# Altium project master.PrjPcb (part 3 of 4)

## Sheet connector_to_BMS_extension.SchDoc: foxBMS BMS-Master
size A3; DocumentNumber: 24; SheetNumber: 24; SheetTotal: 24; Author: Fraunhofer IISB foxBMS Team; REL-DATE: 2017-05-16; VERSION: 1.0.2; SheetDescription: Connectors to BMS-Extension
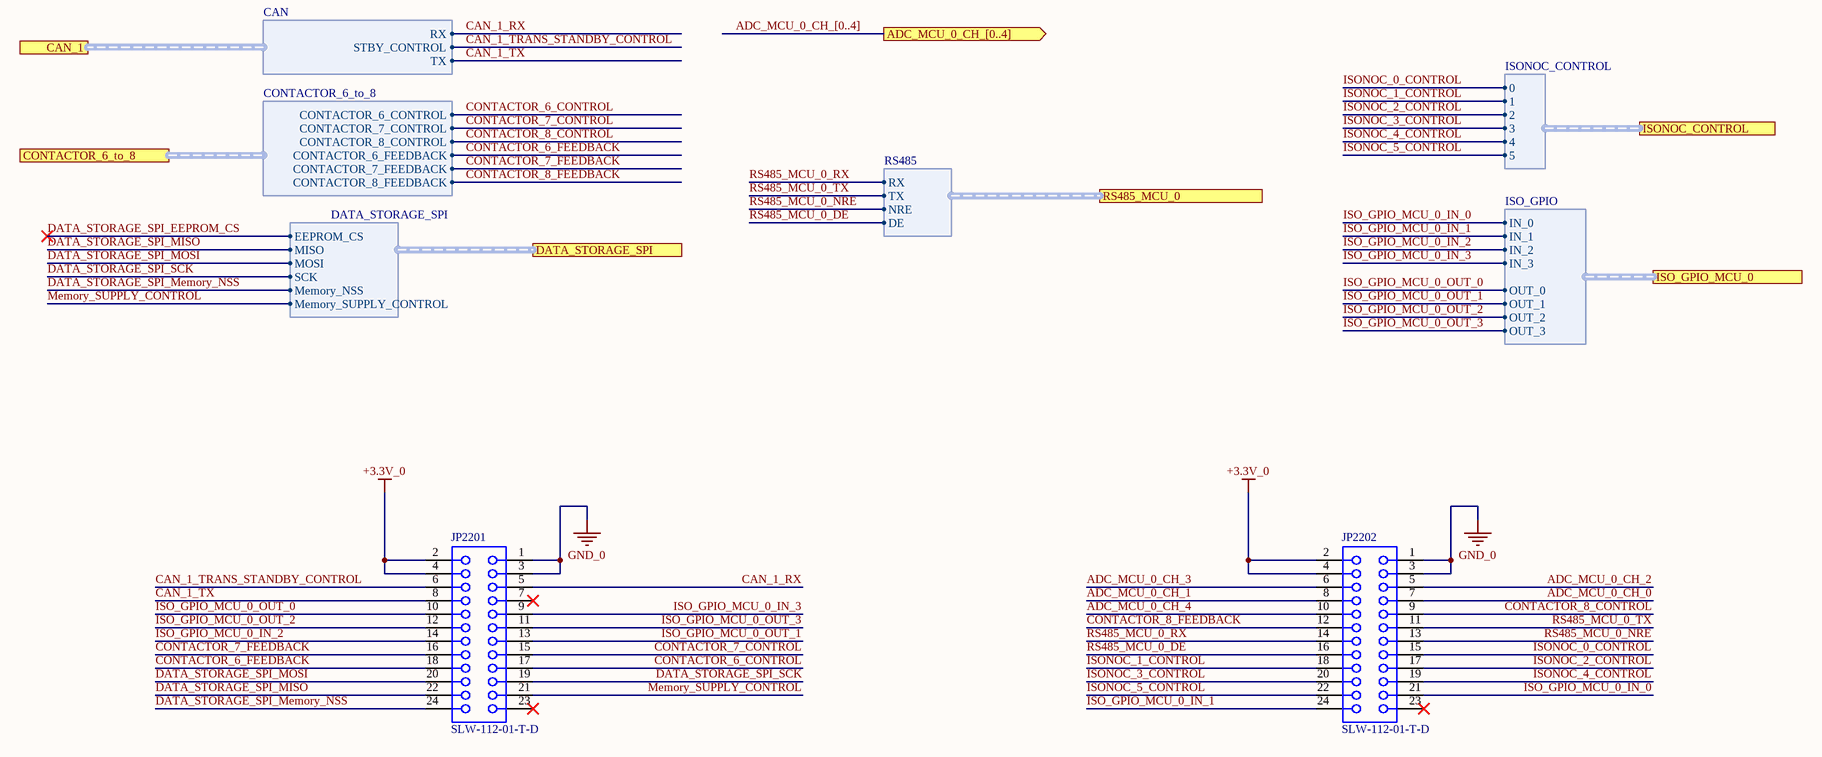
[diagram p17: connector_to_BMS_extension.SchDoc]

### Parts
JP2201  SLW-112-01-T-D  [SMTC-SLW-112-01-X-D]
JP2202  SLW-112-01-T-D  [SMTC-SLW-112-01-X-D]

### Ports
ADC_MCU_0_CH_[0..4] (out), CAN_1 (harness CAN), CONTACTOR_6_to_8 (harness CONTACTOR_6_to_8), DATA_STORAGE_SPI (harness DATA_STORAGE_SPI), ISO_GPIO_MCU_0 (harness ISO_GPIO), ISONOC_CONTROL (harness ISONOC_CONTROL), RS485_MCU_0 (harness RS485)

### Harnesses
CAN: RX, STBY_CONTROL, TX
CONTACTOR_6_to_8: CONTACTOR_6_CONTROL, CONTACTOR_7_CONTROL, CONTACTOR_8_CONTROL, CONTACTOR_6_FEEDBACK, CONTACTOR_7_FEEDBACK, CONTACTOR_8_FEEDBACK
DATA_STORAGE_SPI: EEPROM_CS, MISO, MOSI, SCK, Memory_NSS, Memory_SUPPLY_CONTROL
RS485: RX, TX, NRE, DE
ISONOC_CONTROL: 0, 1, 2, 3, 4, 5
ISO_GPIO: IN_0, IN_1, IN_2, IN_3, OUT_3, OUT_0, OUT_1, OUT_2

### Nets
+3.3V_0: JP2201.2 JP2201.4 JP2202.2 JP2202.4
GND_0: JP2201.1 JP2201.3 JP2202.1 JP2202.3
ADC_MCU_0_CH_0: JP2202.7
ADC_MCU_0_CH_1: JP2202.8
ADC_MCU_0_CH_2: JP2202.5
ADC_MCU_0_CH_3: JP2202.6
ADC_MCU_0_CH_4: JP2202.10
CAN_1_RX: JP2201.5 ; port CAN_1.RX
CAN_1_TRANS_STANDBY_CONTROL: JP2201.6 ; port CAN_1.STBY_CONTROL
CAN_1_TX: JP2201.8 ; port CAN_1.TX
CONTACTOR_6_CONTROL: JP2201.17 ; port CONTACTOR_6_to_8.CONTACTOR_6_CONTROL
CONTACTOR_6_FEEDBACK: JP2201.18 ; port CONTACTOR_6_to_8.CONTACTOR_6_FEEDBACK
CONTACTOR_7_CONTROL: JP2201.15 ; port CONTACTOR_6_to_8.CONTACTOR_7_CONTROL
CONTACTOR_7_FEEDBACK: JP2201.16 ; port CONTACTOR_6_to_8.CONTACTOR_7_FEEDBACK
CONTACTOR_8_CONTROL: JP2202.9 ; port CONTACTOR_6_to_8.CONTACTOR_8_CONTROL
CONTACTOR_8_FEEDBACK: JP2202.12 ; port CONTACTOR_6_to_8.CONTACTOR_8_FEEDBACK
DATA_STORAGE_SPI_Memory_NSS: JP2201.24 ; port DATA_STORAGE_SPI.Memory_NSS
DATA_STORAGE_SPI_MISO: JP2201.22 ; port DATA_STORAGE_SPI.MISO
DATA_STORAGE_SPI_MOSI: JP2201.20 ; port DATA_STORAGE_SPI.MOSI
DATA_STORAGE_SPI_SCK: JP2201.19 ; port DATA_STORAGE_SPI.SCK
ISO_GPIO_MCU_0_IN_0: JP2202.21 ; port ISO_GPIO_MCU_0.IN_0
ISO_GPIO_MCU_0_IN_1: JP2202.24 ; port ISO_GPIO_MCU_0.IN_1
ISO_GPIO_MCU_0_IN_2: JP2201.14 ; port ISO_GPIO_MCU_0.IN_2
ISO_GPIO_MCU_0_IN_3: JP2201.9 ; port ISO_GPIO_MCU_0.IN_3
ISO_GPIO_MCU_0_OUT_0: JP2201.10 ; port ISO_GPIO_MCU_0.OUT_0
ISO_GPIO_MCU_0_OUT_1: JP2201.13 ; port ISO_GPIO_MCU_0.OUT_1
ISO_GPIO_MCU_0_OUT_2: JP2201.12 ; port ISO_GPIO_MCU_0.OUT_2
ISO_GPIO_MCU_0_OUT_3: JP2201.11 ; port ISO_GPIO_MCU_0.OUT_3
ISONOC_0_CONTROL: JP2202.15 ; port ISONOC_CONTROL.0
ISONOC_1_CONTROL: JP2202.18 ; port ISONOC_CONTROL.1
ISONOC_2_CONTROL: JP2202.17 ; port ISONOC_CONTROL.2
ISONOC_3_CONTROL: JP2202.20 ; port ISONOC_CONTROL.3
ISONOC_4_CONTROL: JP2202.19 ; port ISONOC_CONTROL.4
ISONOC_5_CONTROL: JP2202.22 ; port ISONOC_CONTROL.5
Memory_SUPPLY_CONTROL: JP2201.21 ; port DATA_STORAGE_SPI.Memory_SUPPLY_CONTROL
RS485_MCU_0_DE: JP2202.16 ; port RS485_MCU_0.DE
RS485_MCU_0_NRE: JP2202.13 ; port RS485_MCU_0.NRE
RS485_MCU_0_RX: JP2202.14 ; port RS485_MCU_0.RX
RS485_MCU_0_TX: JP2202.11 ; port RS485_MCU_0.TX

Not connected (* = marked no-connect by the designer): JP2201 7* 23*; JP2202 23*

### Buses and harness runs
bus ADC_MCU_0_CH_[0..4] = port ADC_MCU_0_CH_[0..4]

### Notes on the sheet
- Fraunhofer IISB
- Schottkystr. 10
- developed by:
- 91058 Erlangen
- Germany
- Author
- Project
- License
- Description
- File
- Version
- Release Date
- Sheet
- www.foxbms.org
- www.iisb.fraunhofer.de
- foxBMS Team
- /

### Library data of the parts
JP2201 JP2202 = CMP-1023-00145-1: Low Profile Socket Strips, Through-hole, Vertical, -55 to 105 degC, 2.54 mm Pitch, 24-Pin, Female, RoHS; Manufacturer: Samtec; Pitch: 2.54 mm; DatasheetVersion: F-214; ComponentLink3Description: Package Specification; Orientation: Vertical; ComponentLink3URL: http://www.samtec.com/documents/webfiles/cpdf/SLW-1XX-01-X-X-MKT.pdf; ComponentLink1URL: http://www.samtec.com; Temperature Range: -55 to 105 degC; PackageReference: SLW-112-01-X-D; PartNumber: SLW-112-01-T-D; ComponentLink1Description: Manufacturer URL; PackageDescription: Low Profile Socket Strip; Mounting Technology: Through-hole; ComponentLink2Description: Datasheet; RoHS: True; ComponentLink2URL: http://www.samtec.com/documents/webfiles/pdf/SLW.PDF; PackageVersion: X, 9/1987

## Sheet interlock_circuit.SchDoc: foxBMS BMS-Master
size A3; DocumentNumber: 15; SheetNumber: 15; SheetTotal: 24; Author: Fraunhofer IISB foxBMS Team; REL-DATE: 2017-05-16; VERSION: 1.0.2; SheetDescription: Interlock Circuit
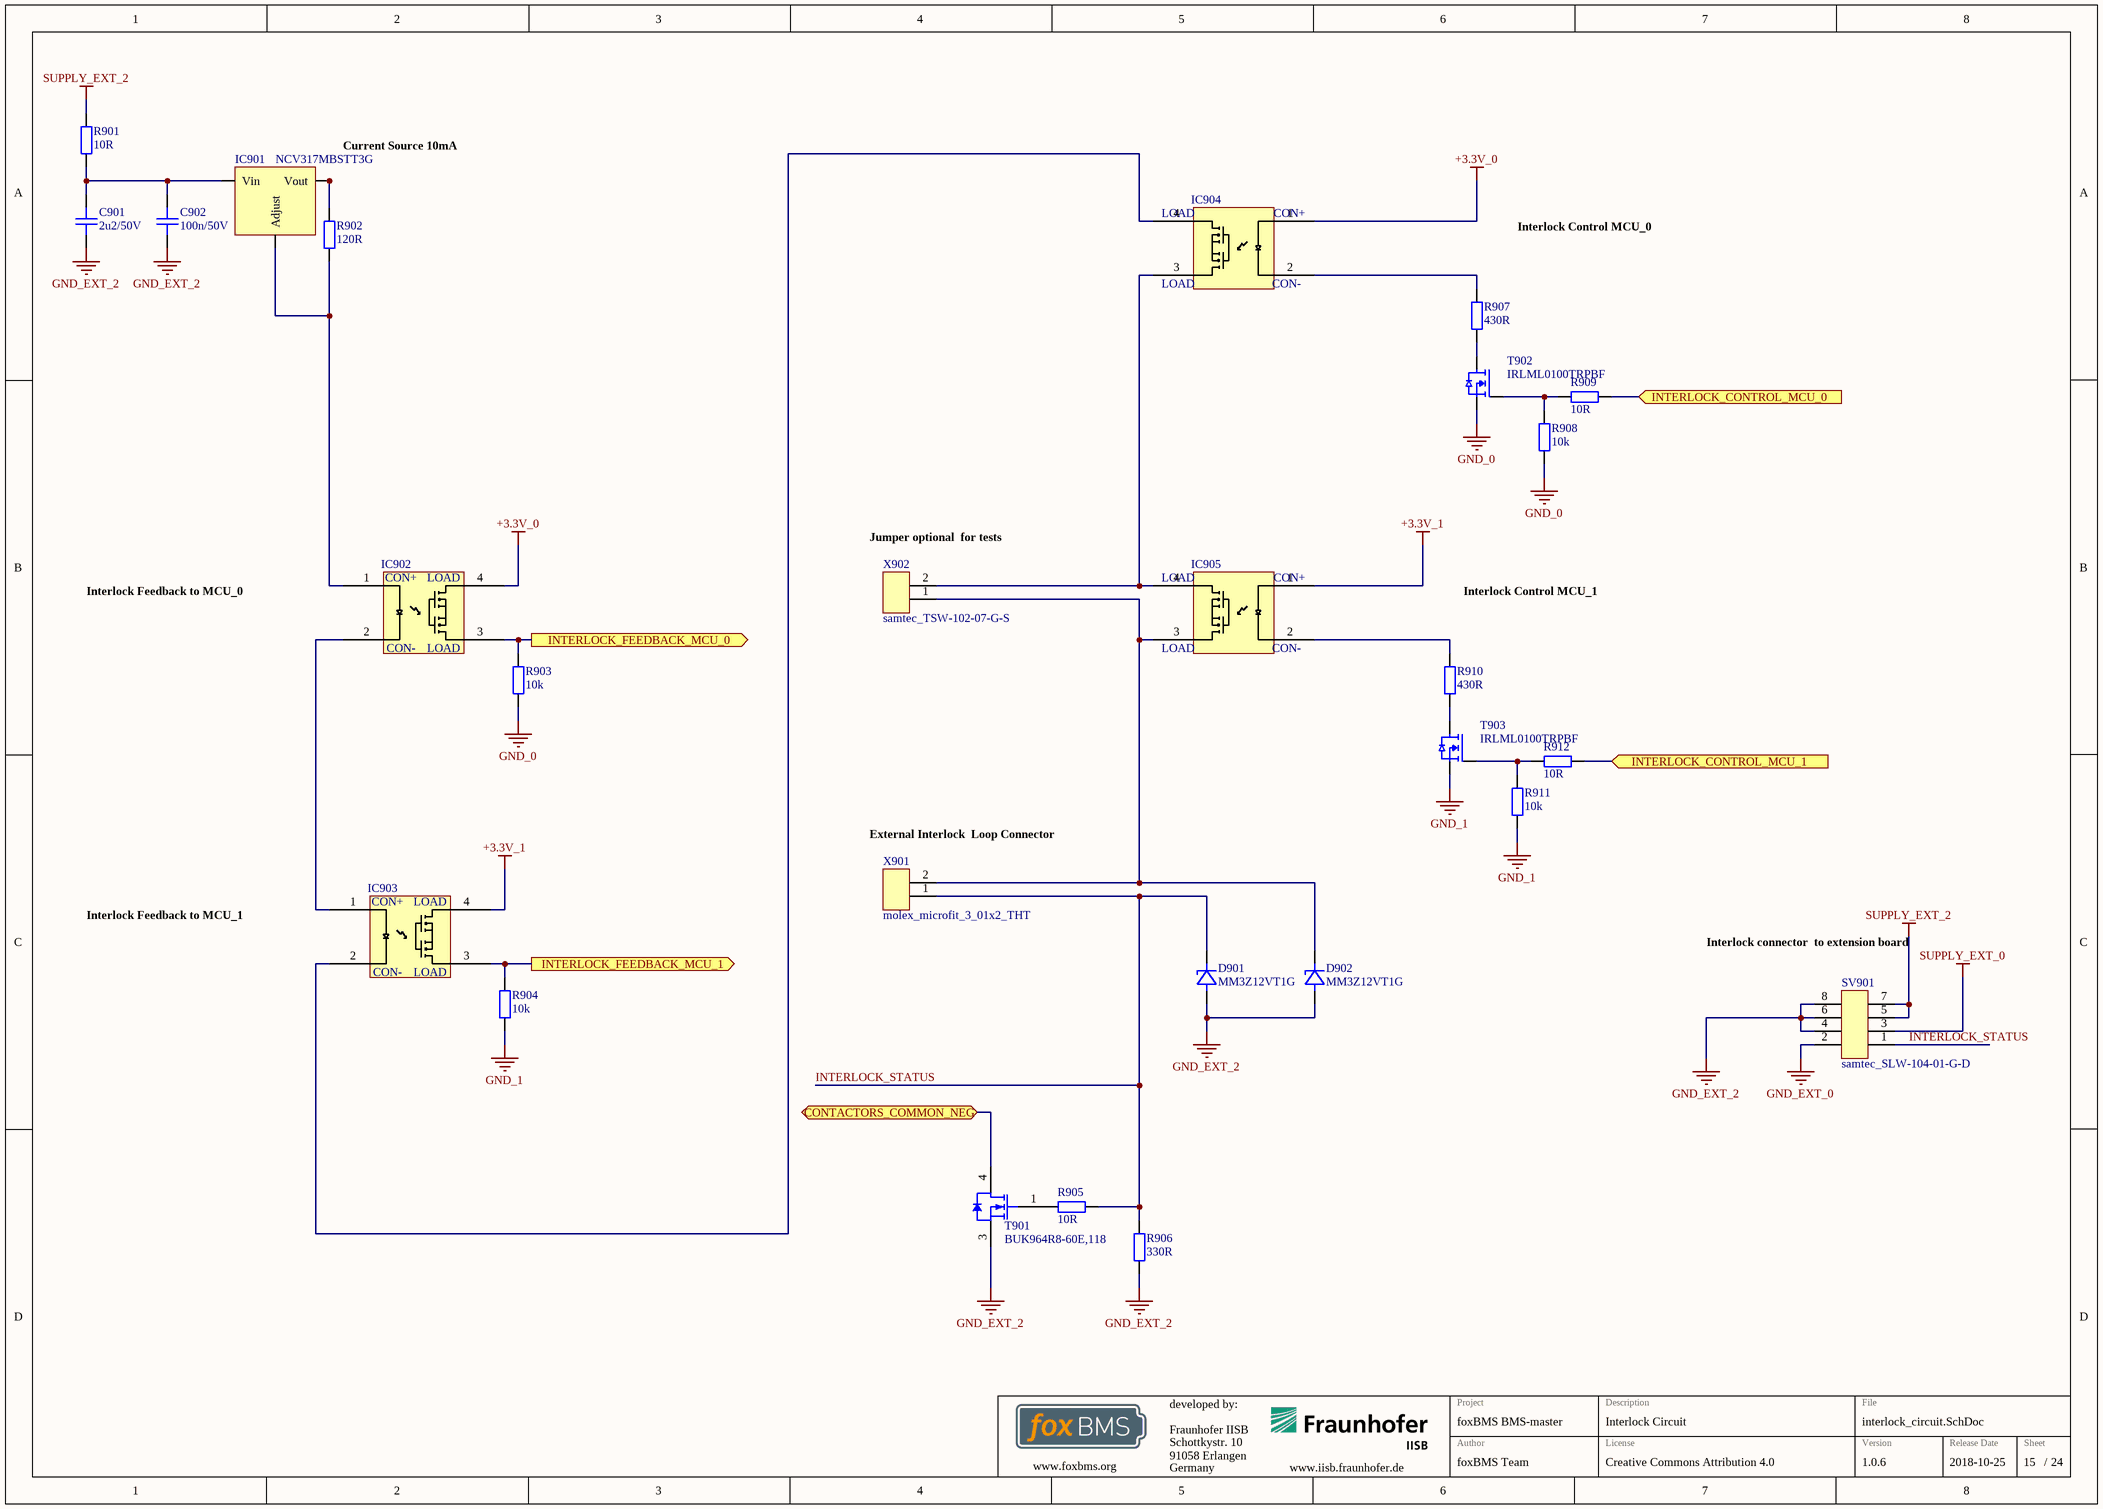
[diagram p18: interlock_circuit.SchDoc]

### Parts
C901  2u2/50V  [CAPC2012X14N]
C902  100n/50V  [CAPC1608X08N]
D901  MM3Z12VT1G  [SODFL250X110-2N]
D902  MM3Z12VT1G  [SODFL250X110-2N]
IC901  NCV317MBSTT3G  [SOT230P700X180-4N]
IC902  CPC1008N  [SOP254P610X218-4N]  (value not drawn)
IC903  CPC1008N  [SOP254P610X218-4N]  (value not drawn)
IC904  CPC1008N  [SOP254P610X218-4N]  (value not drawn)
IC905  CPC1008N  [SOP254P610X218-4N]  (value not drawn)
R901  10R  [RESC1608X05N]
R902  120R  [RESC1608X05N]
R903  10k  [RESC1608X05N]
R904  10k  [RESC1608X05N]
R905  10R  [RESC1608X05N]
R906  330R  [RESC1608X05N]
R907  430R  [RESC1608X05N]
R908  10k  [RESC1608X05N]
R909  10R  [RESC1608X05N]
R910  430R  [RESC1608X05N]
R911  10k  [RESC1608X05N]
R912  10R  [RESC1608X05N]
SV901  samtec_SLW-104-01-G-D  [SLW_104_01_G_D]
T901  BUK964R8-60E,118  [NXP-SOT404_M]
T902  IRLML0100TRPBF  [SOT95P237X110-3N]
T903  IRLML0100TRPBF  [SOT95P237X110-3N]
X901  molex_microfit_3_01x2_THT  [MOLEX_MICROFIT_01x2_THT]
X902  samtec_TSW-102-07-G-S  [Pinheader_2.54_2]

### Ports
CONTACTORS_COMMON_NEG (bidir), INTERLOCK_CONTROL_MCU_0 (in), INTERLOCK_CONTROL_MCU_1 (in), INTERLOCK_FEEDBACK_MCU_0 (out), INTERLOCK_FEEDBACK_MCU_1 (out)

### Nets
+3.3V_0: IC902.4 IC904.1
+3.3V_1: IC903.4 IC905.1
GND_0: R903.1 R908.2 T902.S
GND_1: R904.1 R911.2 T903.S
GND_EXT_0: SV901.2
GND_EXT_2: C901.2 C902.2 D901.2(A) D902.2(A) R906.1 SV901.4 SV901.6 SV901.8 T901.3(S)
SUPPLY_EXT_0: SV901.3
SUPPLY_EXT_2: R901.2 SV901.5 SV901.7
CONTACTORS_COMMON_NEG: T901.4(D) ; port CONTACTORS_COMMON_NEG
INTERLOCK_CONTROL_MCU_0: R909.2 ; port INTERLOCK_CONTROL_MCU_0
INTERLOCK_CONTROL_MCU_1: R912.2 ; port INTERLOCK_CONTROL_MCU_1
INTERLOCK_FEEDBACK_MCU_0: IC902.3 R903.2 ; port INTERLOCK_FEEDBACK_MCU_0
INTERLOCK_FEEDBACK_MCU_1: IC903.3 R904.2 ; port INTERLOCK_FEEDBACK_MCU_1
INTERLOCK_STATUS: D901.1(K) R905.1 R906.2 SV901.1 X901.1
NetC901_1: C901.1 C902.1 IC901.3(Vin) R901.1
NetD902_1: D902.1(K) IC905.3 X901.2 X902.1
NetIC901_1: IC901.1(Adjust) IC902.1 R902.1
NetIC901_2: IC901.2(Vout) IC901.4(Vout) R902.2
NetIC902_2: IC902.2 IC903.1
NetIC903_2: IC903.2 IC904.4
NetIC904_2: IC904.2 R907.2
NetIC904_3: IC904.3 IC905.4 X902.2
NetIC905_2: IC905.2 R910.2
NetR905_2: R905.2 T901.1(G)
NetR907_1: R907.1 T902.D
NetR908_1: R908.1 R909.1 T902.G
NetR910_1: R910.1 T903.D
NetR911_1: R911.1 R912.1 T903.G

### Notes on the sheet
- (near IC901) Current Source 10mA
- Interlock Control MCU_0
- (near X902) Jumper optional
  for tests
- Interlock Feedback to MCU_0
- Interlock Control MCU_1
- (near X901) External Interlock
  Loop Connector
- Interlock Feedback to MCU_1
- Interlock connector
  to extension board
- Fraunhofer IISB
- Schottkystr. 10
- developed by:
- 91058 Erlangen
- Germany
- Author
- Project
- License
- Description
- File
- Version
- Release Date
- Sheet
- www.foxbms.org
- www.iisb.fraunhofer.de
- foxBMS Team
- /
- (in symbol CPC1008N) CON+; LOAD; CON-

### Library data of the parts
C901 = gen_C_ceramic_2u2_50V_X7R_0805: MLCC; Capacitance: 2u2; Rated Voltage: 50V; Dielectric: X7R; Case EIA: 0805; Case Metric: 2012; Automotive Qualified: False; Part Number: gen_C_ceramic_2u2_50V_X7R_0805; Supplier 1: Farnell; Supplier Part Number 1: 2547054
C902 = gen_C_ceramic_100n_50V_X7R_0603: as C1402-C1405 on sheet isolated_USB; Part Number: gen_C_ceramic_100n_50V_X7R_0603; Supplier 1: Farnell; Supplier Part Number 1: 2525267; Supplier 2: Digikey; Supplier Part Number 2: 490-6049-1-ND
D901 D902 = MM3Z12VT1G: Zener Diode; Manufacturer: ON Semiconductor; Breakdown Voltage: 12V; PnP Package: SOD323; Automotive Qualified: True; Part Number: MM3Z12VT1G; Part Name: MM3Z12VT1G; Operating Temperature: *; Continuous Forward Current: *; ComponentLink1Description: Datasheet; ComponentLink1URL: http://www.farnell.com/datasheets/1876691.pdf; Supplier 1: Farnell; Supplier Part Number 1: 1431191; Supplier 2: Digikey; Supplier Part Number 2: MM3Z12VT1GOSCT-ND; Supplier 3: Mouser; Supplier Part Number 3: 863-MM3Z12VT1G
IC901 = NCV317MBSTT3G: 500mA Adjustable Output, Positive Voltage Regulator; Manufacturer: ON Semiconductor; Automotive Qualified: True; Part Number: NCV317MBSTT3G; Part Name: NCV317MBSTT3G; Operating Temperature: -40°C - +125°C; ComponentLink1Description: Datasheet; ComponentLink1URL: http://www.farnell.com/datasheets/2353745.pdf; Supplier 1: Digikey; Supplier Part Number 1: NCV317MBSTT3GOSCT-ND; Supplier 2: Mouser; Supplier Part Number 2: 863-NCV317MBSTT3G
IC902-IC905 = CPC1008N: Single-Pole, Normally Open 4-Pin SOP OptoMOS Relay; Manufacturer: CLARE; Automotive Qualified: False; Part Number: CPC1008N; Part Name: CPC1008N; Operating Temperature: -40°C - +85°C; ComponentLink1Description: Datasheet; ComponentLink1URL: http://www.farnell.com/datasheets/1924621.pdf; Supplier 1: Farnell; Supplier Part Number 1: 1653755
R901 R905 R909 R912 = gen_R_10R_0603: SMD Resistor 10R 0603; Tolerance: 1%; Power: 0.1W; Case EIA: 0603; Case Metric: 1608; Maximum Working Voltage: 75V; PnP Package: R_0603; Automotive Qualified: False; Part Number: gen_R_10R_0603; Operating Temperature: -55°C - +155°C; Resistance: 10R; Series: E24, E96; PnP Value: 10R; Supplier 1: Farnell; Supplier Part Number 1: 2073361
R902 = gen_R_120R_0603: SMD Resistor 120R 0603; Tolerance: 1%; Power: 0.1W; Case EIA: 0603; Case Metric: 1608; Maximum Working Voltage: 75V; PnP Package: R_0603; Automotive Qualified: False; Part Number: gen_R_120R_0603; Operating Temperature: -55°C - +155°C; Resistance: 120R; Series: E24; PnP Value: 120R; Supplier 1: Farnell; Supplier Part Number 1: 2073369
R903 R904 R908 R911 = gen_R_10k_0603: SMD Resistor 10k 0603; Tolerance: 1%; Power: 0.1W; Case EIA: 0603; Case Metric: 1608; Maximum Working Voltage: 75V; PnP Package: R_0603; Automotive Qualified: False; Part Number: gen_R_10k_0603; Operating Temperature: -55°C - +155°C; Resistance: 10k; Series: E24, E96; PnP Value: 10k; Supplier 1: Farnell; Supplier Part Number 1: 2073349
R906 = gen_R_330R_0603: SMD Resistor 330R 0603; Tolerance: 1%; Power: 0.1W; Case EIA: 0603; Case Metric: 1608; Maximum Working Voltage: 75V; PnP Package: R_0603; Automotive Qualified: False; Part Number: gen_R_330R_0603; Operating Temperature: -55°C - +155°C; Resistance: 330R; Series: E24; PnP Value: 330R; Supplier 1: Farnell; Supplier Part Number 1: 2692155
R907 R910 = gen_R_430R_0603: SMD Resistor 430R 0603; Tolerance: 1%; Power: 0.1W; Case EIA: 0603; Case Metric: 1608; Maximum Working Voltage: 75V; PnP Package: R_0603; Automotive Qualified: False; Part Number: gen_R_430R_0603; Operating Temperature: -55°C - +155°C; Resistance: 430R; Series: E24; PnP Value: 430R; Supplier 1: Farnell; Supplier Part Number 1: 2074259
SV901 = samtec_SLW-104-01-G-D: Board-To-Board Connector, Dual, 2.54 mm, 8 Contacts, Receptacle, SLW Series, Through Hole, 2 Rows; Manufacturer: Samtec; Circuits: 8; Rated Voltage: 406VAC Voltage rating; Rated Current: 5.2A; Automotive Qualified: False; Part Number: samtec_SLW-104-01-G-D; Part Name: SLW-104-01-G-D; Operating Temperature: -55°C - +125°C; ComponentLink1Description: Datasheet; ComponentLink1URL: http://www.farnell.com/datasheets/1927699.pdf; Supplier 1: Farnell; Supplier Part Number 1: 1668094
T901 = CMP-1259-00124-1: N-Channel TrenchMOS Logic Level FET, 60 V, 100 A, 3-Pin SOT404, Tape and Reel; Manufacturer: NXP Semiconductors; Channel Type: N; ID [max] (A): 100; Automotive Qualified: Y; IDM [max] (A): 596; VGSth [typ] (V): 1.7; VDS [max] (V): 60; Packing: Tape & Reel; Qr [typ] (nC): 56; PackageDescription: 3-Pin Plastic Single-ended Surface Mounted Package, Body 10 x 9.6 mm, Pitch 2.54 mm; Mounting Technology: Surface Mount; ComponentLink3URL: http://www.nxp.com/documents/outline_drawing/sot404_po.pdf; ComponentLink1Description: Manufacturer URL; ComponentLink2URL: http://www.nxp.com/documents/data_sheet/BUK964R8-60E.pdf; PackageVersion: 13-02-25, 02/2013; ComponentLink2Description: Datasheet; PartNumber: BUK964R8-60E,118; ComponentLink1URL: http://www.nxp.com/; ComponentLink3Description: Package Specification; PackageReference: SOT404
T902 T903 = IRLML0100TRPBF: MOSFET-Transistor, n-Kanal, 1.6 A, 100 V, 0.178 ohm, 10 V, 2.5 V; Manufacturer: Infineon; Maximum Drain-Source Voltage: 100V; Maximum Continous Drain Current (25°C): 1.6A; R_DS(on): 190m; Total Gate Charge: 2.5nC; Automotive Qualified: False; Part Number: IRLML0100TRPBF; Part Name: NMOS; Operating Temperature: -55°C - +150°C; ComponentLink1Description: Datasheet URL; ComponentLink1URL: http://www.farnell.com/datasheets/491501.pdf; Supplier 1: Farnell; Supplier Part Number 1: 1783928
X901 = molex_microfit_3_01x2_THT: Micro-Fit 3.0 Right Angle Header, 3.00mm Pitch, Dual Row, 2 Circuits, with Snap-in Plastic Peg PCB Lock, Tin, Glow Wire Capable, Black, 43045-0200; Manufacturer: Molex; Circuits: 2; Rated Voltage: 600V; Rated Current: 8.5A; Automotive Qualified: False; Part Number: molex_microfit_3_01x2_THT; Part Name: MicroFit; Operating Temperature: -40°C - +105°C; Supplier 1: Farnell; Supplier Part Number 1: 1012251
X902 = samtec_TSW-102-07-G-S: Board-To-Board Connector, Vertical, 2.54 mm, 2 Contacts, Header, TSW Series, Through Hole, 1 Row; Manufacturer: Samtec; Circuits: 2; Automotive Qualified: False; Part Number: samtec_TSW-102-07-G-S; Part Name: TSW-102-07-G-S; Operating Temperature: -55°C - +125°C; ComponentLink1Description: Datasheet; ComponentLink1URL: http://www.farnell.com/datasheets/1796313.pdf; Supplier 1: Farnell; Supplier Part Number 1: 2505044

## Sheet contactor_control.SchDoc: foxBMS BMS-Master
size A3; DocumentNumber: 16; SheetNumber: 16; SheetTotal: 24; Author: Fraunhofer IISB foxBMS Team; REL-DATE: 2017-05-16; VERSION: 1.0.2; SheetDescription: Contactor Control
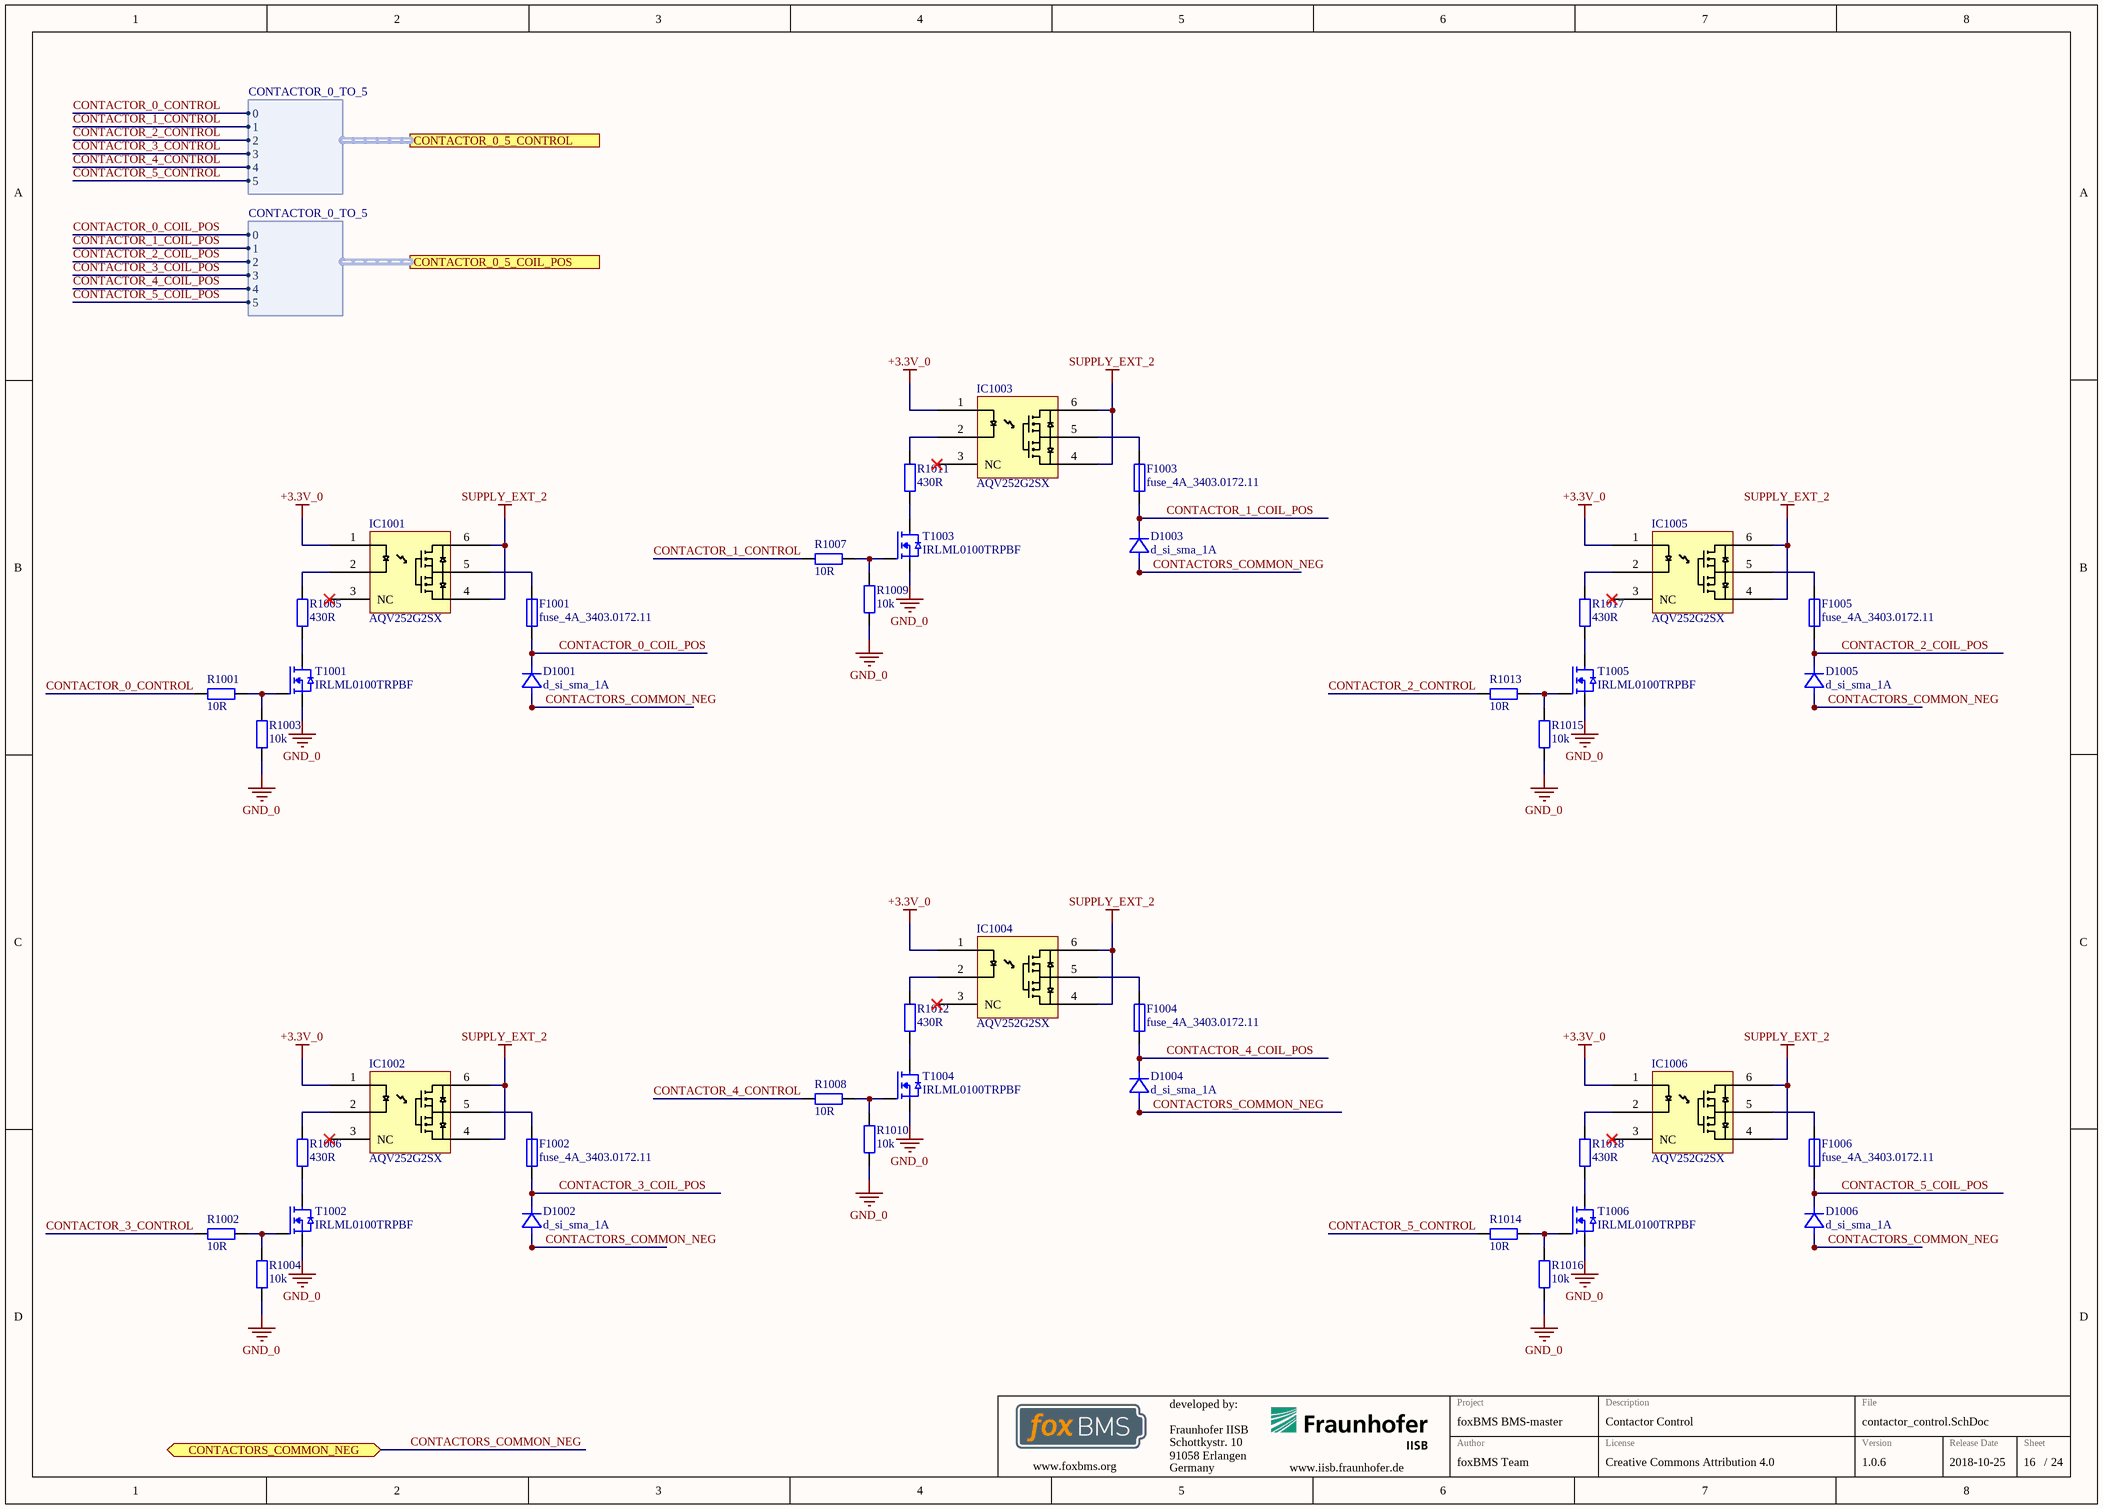
[diagram p19: contactor_control.SchDoc]

### Parts
D1001  d_si_sma_1A  [DIOM4326X24N]
D1002  d_si_sma_1A  [DIOM4326X24N]
D1003  d_si_sma_1A  [DIOM4326X24N]
D1004  d_si_sma_1A  [DIOM4326X24N]
D1005  d_si_sma_1A  [DIOM4326X24N]
D1006  d_si_sma_1A  [DIOM4326X24N]
F1001  fuse_4A_3403.0172.11  [Schurter_UMT_250]
F1002  fuse_4A_3403.0172.11  [Schurter_UMT_250]
F1003  fuse_4A_3403.0172.11  [Schurter_UMT_250]
F1004  fuse_4A_3403.0172.11  [Schurter_UMT_250]
F1005  fuse_4A_3403.0172.11  [Schurter_UMT_250]
F1006  fuse_4A_3403.0172.11  [Schurter_UMT_250]
IC1001  AQV252G2SX  [SOP254P680X220-6N]
IC1002  AQV252G2SX  [SOP254P680X220-6N]
IC1003  AQV252G2SX  [SOP254P680X220-6N]
IC1004  AQV252G2SX  [SOP254P680X220-6N]
IC1005  AQV252G2SX  [SOP254P680X220-6N]
IC1006  AQV252G2SX  [SOP254P680X220-6N]
R1001  10R  [RESC1608X05N]
R1002  10R  [RESC1608X05N]
R1003  10k  [RESC1608X05N]
R1004  10k  [RESC1608X05N]
R1005  430R  [RESC1608X05N]
R1006  430R  [RESC1608X05N]
R1007  10R  [RESC1608X05N]
R1008  10R  [RESC1608X05N]
R1009  10k  [RESC1608X05N]
R1010  10k  [RESC1608X05N]
R1011  430R  [RESC1608X05N]
R1012  430R  [RESC1608X05N]
R1013  10R  [RESC1608X05N]
R1014  10R  [RESC1608X05N]
R1015  10k  [RESC1608X05N]
R1016  10k  [RESC1608X05N]
R1017  430R  [RESC1608X05N]
R1018  430R  [RESC1608X05N]
T1001  IRLML0100TRPBF  [SOT95P237X110-3N]
T1002  IRLML0100TRPBF  [SOT95P237X110-3N]
T1003  IRLML0100TRPBF  [SOT95P237X110-3N]
T1004  IRLML0100TRPBF  [SOT95P237X110-3N]
T1005  IRLML0100TRPBF  [SOT95P237X110-3N]
T1006  IRLML0100TRPBF  [SOT95P237X110-3N]

### Ports
CONTACTOR_0_5_COIL_POS (harness CONTACTOR_0_TO_5), CONTACTOR_0_5_CONTROL (harness CONTACTOR_0_TO_5), CONTACTORS_COMMON_NEG (bidir)

### Harnesses
CONTACTOR_0_TO_5: 0, 1, 2, 3, 4, 5

### Nets
+3.3V_0: IC1001.1 IC1002.1 IC1003.1 IC1004.1 IC1005.1 IC1006.1
GND_0: R1003.1 R1004.1 R1009.1 R1010.1 R1015.1 R1016.1 T1001.S T1002.S T1003.S T1004.S T1005.S T1006.S
SUPPLY_EXT_2: IC1001.4 IC1001.6 IC1002.4 IC1002.6 IC1003.4 IC1003.6 IC1004.4 IC1004.6 IC1005.4 IC1005.6 IC1006.4 IC1006.6
CONTACTOR_0_COIL_POS: D1001.1(K) F1001.2 ; port CONTACTOR_0_5_COIL_POS.0
CONTACTOR_0_CONTROL: R1001.2 ; port CONTACTOR_0_5_CONTROL.0
CONTACTOR_1_COIL_POS: D1003.1(K) F1003.2 ; port CONTACTOR_0_5_COIL_POS.1
CONTACTOR_1_CONTROL: R1007.2 ; port CONTACTOR_0_5_CONTROL.1
CONTACTOR_2_COIL_POS: D1005.1(K) F1005.2 ; port CONTACTOR_0_5_COIL_POS.2
CONTACTOR_2_CONTROL: R1013.2 ; port CONTACTOR_0_5_CONTROL.2
CONTACTOR_3_COIL_POS: D1002.1(K) F1002.2 ; port CONTACTOR_0_5_COIL_POS.3
CONTACTOR_3_CONTROL: R1002.2 ; port CONTACTOR_0_5_CONTROL.3
CONTACTOR_4_COIL_POS: D1004.1(K) F1004.2 ; port CONTACTOR_0_5_COIL_POS.4
CONTACTOR_4_CONTROL: R1008.2 ; port CONTACTOR_0_5_CONTROL.4
CONTACTOR_5_COIL_POS: D1006.1(K) F1006.2 ; port CONTACTOR_0_5_COIL_POS.5
CONTACTOR_5_CONTROL: R1014.2 ; port CONTACTOR_0_5_CONTROL.5
CONTACTORS_COMMON_NEG: D1001.2(A) D1002.2(A) D1003.2(A) D1004.2(A) D1005.2(A) D1006.2(A) ; port CONTACTORS_COMMON_NEG
NetF1001_1: F1001.1 IC1001.5
NetF1002_1: F1002.1 IC1002.5
NetF1003_1: F1003.1 IC1003.5
NetF1004_1: F1004.1 IC1004.5
NetF1005_1: F1005.1 IC1005.5
NetF1006_1: F1006.1 IC1006.5
NetIC1001_2: IC1001.2 R1005.2
NetIC1002_2: IC1002.2 R1006.2
NetIC1003_2: IC1003.2 R1011.2
NetIC1004_2: IC1004.2 R1012.2
NetIC1005_2: IC1005.2 R1017.2
NetIC1006_2: IC1006.2 R1018.2
NetR1001_1: R1001.1 R1003.2 T1001.G
NetR1002_1: R1002.1 R1004.2 T1002.G
NetR1005_1: R1005.1 T1001.D
NetR1006_1: R1006.1 T1002.D
NetR1007_1: R1007.1 R1009.2 T1003.G
NetR1008_1: R1008.1 R1010.2 T1004.G
NetR1011_1: R1011.1 T1003.D
NetR1012_1: R1012.1 T1004.D
NetR1013_1: R1013.1 R1015.2 T1005.G
NetR1014_1: R1014.1 R1016.2 T1006.G
NetR1017_1: R1017.1 T1005.D
NetR1018_1: R1018.1 T1006.D

Not connected (* = marked no-connect by the designer): IC1001 3(NC)*; IC1002 3(NC)*; IC1003 3(NC)*; IC1004 3(NC)*; IC1005 3(NC)*; IC1006 3(NC)*

### Notes on the sheet
- Fraunhofer IISB
- Schottkystr. 10
- developed by:
- 91058 Erlangen
- Germany
- Author
- Project
- License
- Description
- File
- Version
- Release Date
- Sheet
- www.foxbms.org
- www.iisb.fraunhofer.de
- foxBMS Team
- /

### Library data of the parts
D1001-D1006 = d_si_sma_1A: Standard Recovery Diode, 100 V, 1 A, Single, 1 V, 2 µs, 30 A; Part Name: GF1B; Manufacturer: ON Semiconductor; Breakdown Voltage: 100V; Continuous Forward Current: 1A; Automotive Qualified: False; Part Number: d_si_sma_1A; Operating Temperature: -65°C - +175°C; ComponentLink1Description: Datasheet; ComponentLink1URL: http://www.farnell.com/datasheets/2303965.pdf; Supplier 1: Farnell; Supplier Part Number 1: 1467477
F1001-F1006 = fuse_4A_3403.0172.11: Schurter SMD Fuse 4.0A UMT 3403.0172.11; Automotive Qualified: False; Part Number: fuse_4A_3403.0172.11; Manufacturer: Schurter; Operating Temperature: -55°C - +125°C; ComponentLink1Description: Catalog Page Digikey; ComponentLink1URL: http://dkc3.digikey.com/PDF/DE2011-DE/P2352.pdf; Supplier 1: Digikey; Supplier Part Number 1: 486-1253-ND; Supplier 2: Mouser; Supplier Part Number 2: 693-3403.0172.11
IC1001-IC1006 = AQV252G2SX: PhotoMOS Relay; Manufacturer: Panasonic; Automotive Qualified: False; Part Number: AQV252G2SX; Part Name: AQV252G2SX; Operating Temperature: -40°C - +85°C; Supplier 1: Digikey; Supplier Part Number 1: 255-3594-1-ND; Supplier 2: Farnell; Supplier Part Number 2: 2302216
R1001 R1002 R1007 R1008 R1013 R1014 = gen_R_10R_0603: as R901 on sheet interlock_circuit; Part Number: gen_R_10R_0603; Operating Temperature: -55°C - +155°C; Resistance: 10R; Series: E24, E96; PnP Value: 10R; Supplier 1: Farnell; Supplier Part Number 1: 2073361
R1003 R1004 R1009 R1010 R1015 R1016 = gen_R_10k_0603: as R903 on sheet interlock_circuit; Part Number: gen_R_10k_0603; Operating Temperature: -55°C - +155°C; Resistance: 10k; Series: E24, E96; PnP Value: 10k; Supplier 1: Farnell; Supplier Part Number 1: 2073349
R1005 R1006 R1011 R1012 R1017 R1018 = gen_R_430R_0603: as R907 on sheet interlock_circuit; Part Number: gen_R_430R_0603; Operating Temperature: -55°C - +155°C; Resistance: 430R; Series: E24; PnP Value: 430R; Supplier 1: Farnell; Supplier Part Number 1: 2074259
T1001-T1006 = IRLML0100TRPBF: as T902 on sheet interlock_circuit; Part Number: IRLML0100TRPBF; Part Name: NMOS; Operating Temperature: -55°C - +150°C; ComponentLink1Description: Datasheet URL; ComponentLink1URL: http://www.farnell.com/datasheets/491501.pdf; Supplier 1: Farnell; Supplier Part Number 1: 1783928

## Sheet contactor_feedback.SchDoc: foxBMS BMS-Master
size A3; DocumentNumber: 17; SheetNumber: 17; SheetTotal: 24; Author: Fraunhofer IISB foxBMS Team; REL-DATE: 2017-05-16; VERSION: 1.0.2; SheetDescription: Contactor Feedback
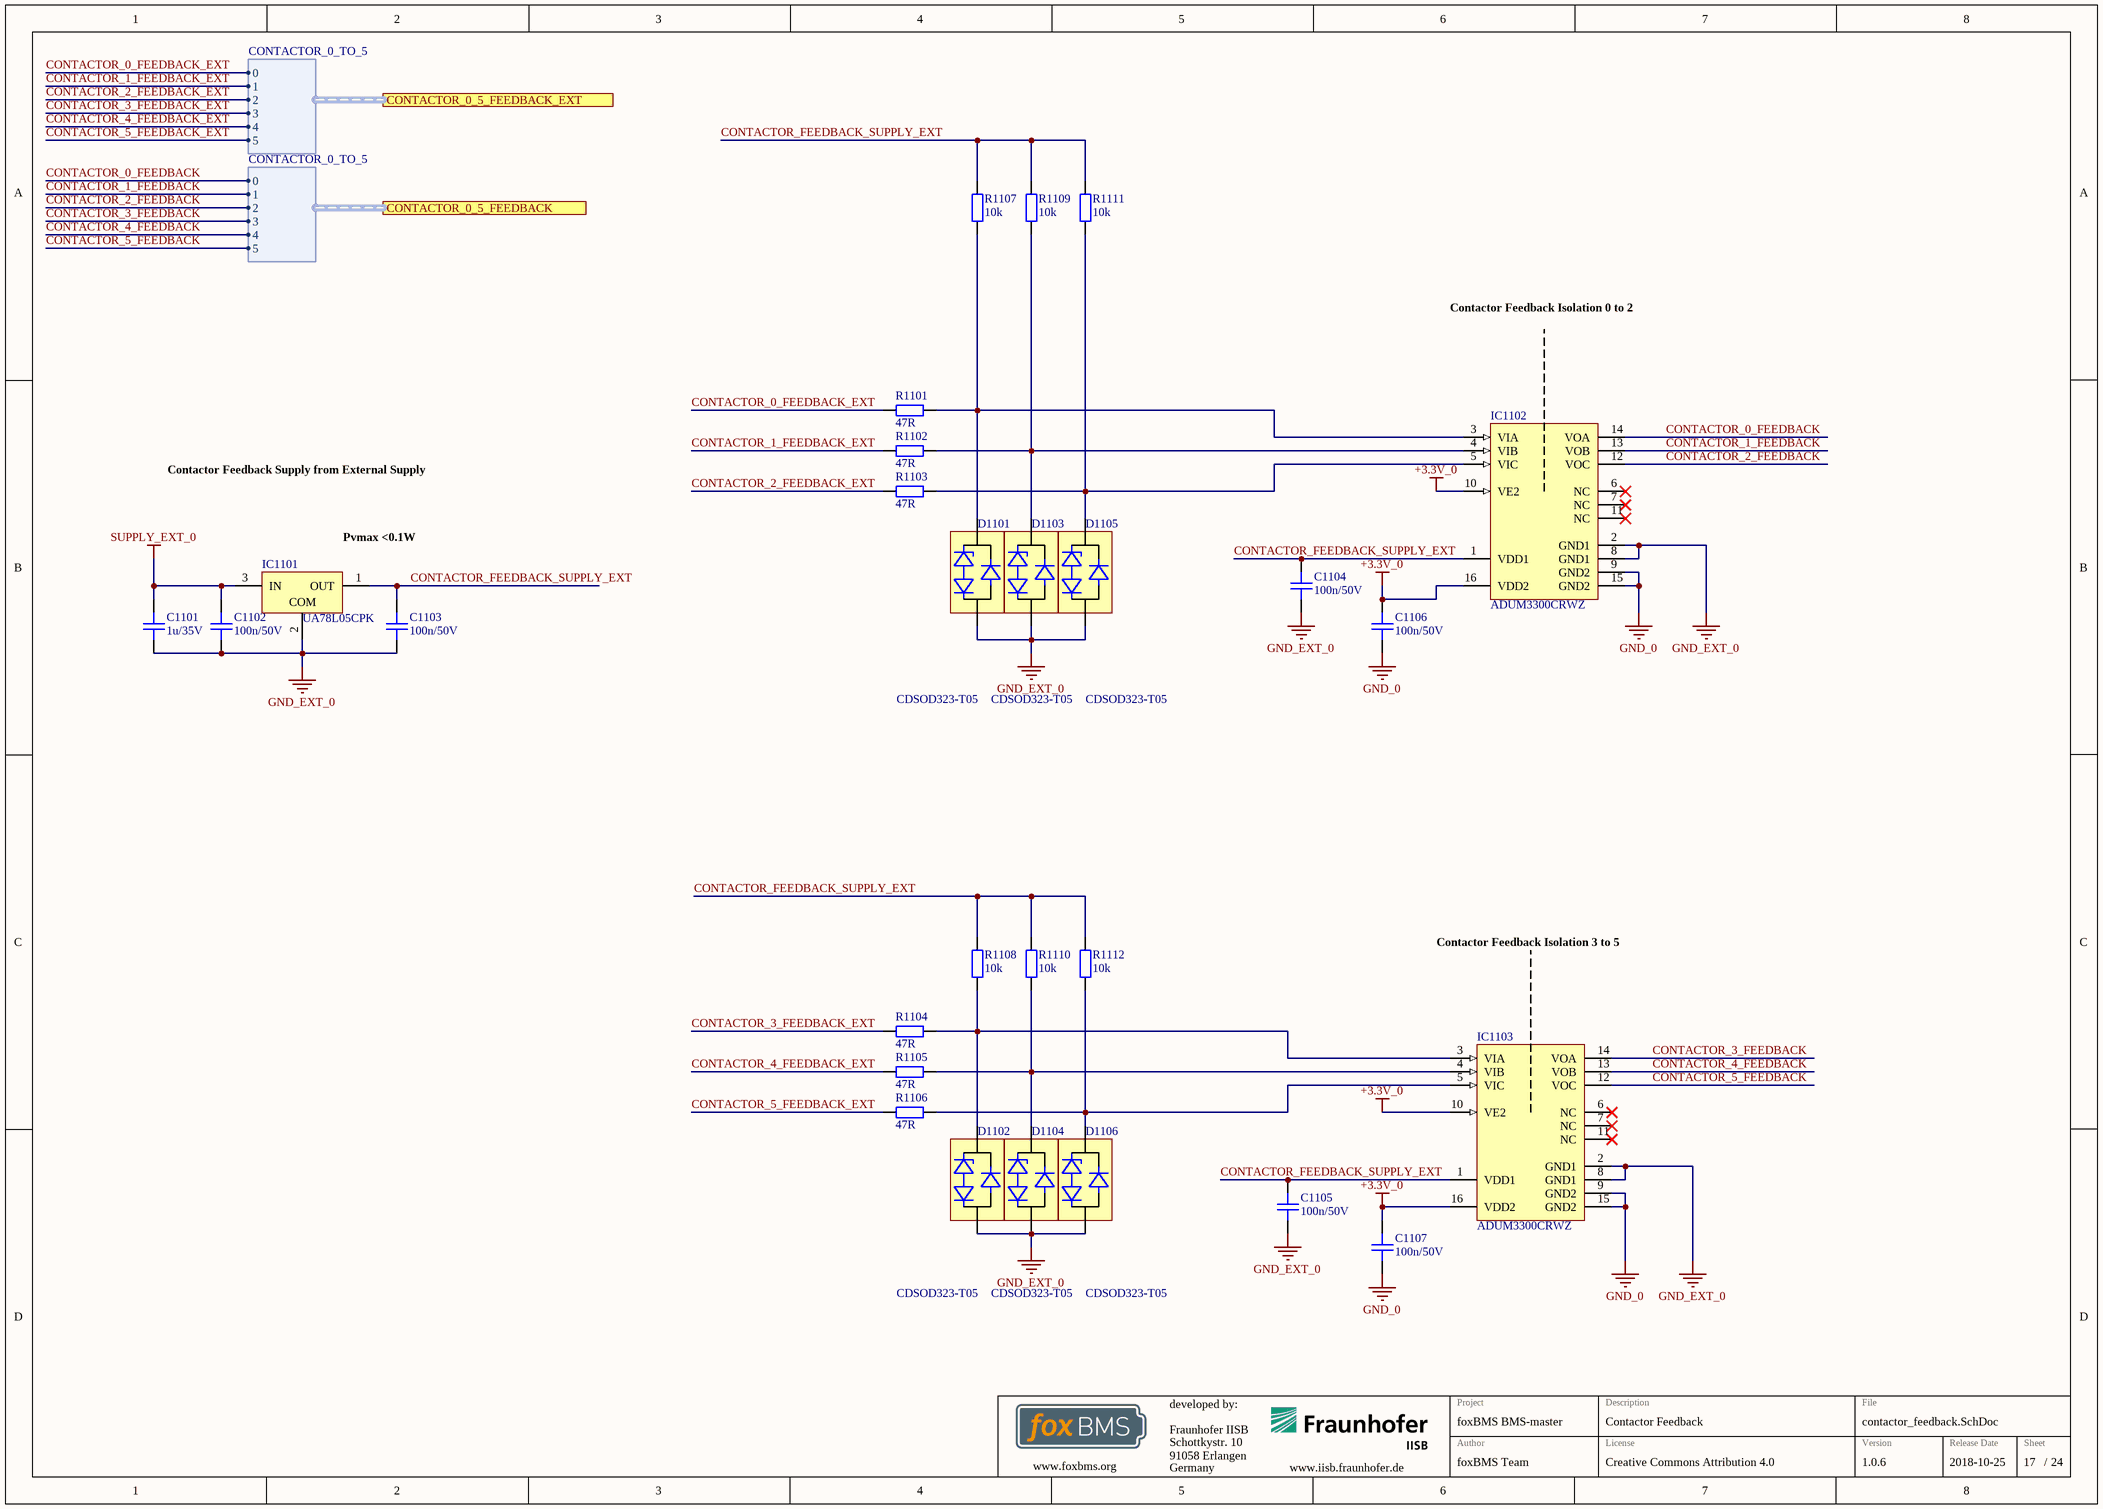
[diagram p20: contactor_feedback.SchDoc]

### Parts
C1101  1u/35V  [CAPC1608X08N]
C1102  100n/50V  [CAPC1608X08N]
C1103  100n/50V  [CAPC1608X08N]
C1104  100n/50V  [CAPC1608X08N]
C1105  100n/50V  [CAPC1608X08N]
C1106  100n/50V  [CAPC1608X08N]
C1107  100n/50V  [CAPC1608X08N]
D1101  CDSOD323-T05  [SODFL250X110-2N]
D1102  CDSOD323-T05  [SODFL250X110-2N]
D1103  CDSOD323-T05  [SODFL250X110-2N]
D1104  CDSOD323-T05  [SODFL250X110-2N]
D1105  CDSOD323-T05  [SODFL250X110-2N]
D1106  CDSOD323-T05  [SODFL250X110-2N]
IC1101  UA78L05CPK  [PK0003A_L]
IC1102  ADUM3300CRWZ  [ADI-RW-16_L]
IC1103  ADUM3300CRWZ  [ADI-RW-16_L]
R1101  47R  [RESC1608X05N]
R1102  47R  [RESC1608X05N]
R1103  47R  [RESC1608X05N]
R1104  47R  [RESC1608X05N]
R1105  47R  [RESC1608X05N]
R1106  47R  [RESC1608X05N]
R1107  10k  [RESC1608X05N]
R1108  10k  [RESC1608X05N]
R1109  10k  [RESC1608X05N]
R1110  10k  [RESC1608X05N]
R1111  10k  [RESC1608X05N]
R1112  10k  [RESC1608X05N]

### Ports
CONTACTOR_0_5_FEEDBACK (harness CONTACTOR_0_TO_5), CONTACTOR_0_5_FEEDBACK_EXT (harness CONTACTOR_0_TO_5)

### Harnesses
CONTACTOR_0_TO_5: 0, 1, 2, 3, 4, 5

### Nets
+3.3V_0: C1106.1 C1107.1 IC1102.10(VE2) IC1102.16(VDD2) IC1103.10(VE2) IC1103.16(VDD2)
GND_0: C1106.2 C1107.2 IC1102.9(GND2) IC1102.15(GND2) IC1103.9(GND2) IC1103.15(GND2)
GND_EXT_0: C1101.2 C1102.2 C1103.2 C1104.2 C1105.2 D1101.2(A) D1102.2(A) D1103.2(A) D1104.2(A) D1105.2(A) D1106.2(A) IC1101.2(COM) IC1102.2(GND1) IC1102.8(GND1) IC1103.2(GND1) IC1103.8(GND1)
SUPPLY_EXT_0: C1101.1 C1102.1 IC1101.3(IN)
CONTACTOR_0_FEEDBACK: IC1102.14(VOA) ; port CONTACTOR_0_5_FEEDBACK.0
CONTACTOR_0_FEEDBACK_EXT: R1101.1 ; port CONTACTOR_0_5_FEEDBACK_EXT.0
CONTACTOR_1_FEEDBACK: IC1102.13(VOB) ; port CONTACTOR_0_5_FEEDBACK.1
CONTACTOR_1_FEEDBACK_EXT: R1102.1 ; port CONTACTOR_0_5_FEEDBACK_EXT.1
CONTACTOR_2_FEEDBACK: IC1102.12(VOC) ; port CONTACTOR_0_5_FEEDBACK.2
CONTACTOR_2_FEEDBACK_EXT: R1103.1 ; port CONTACTOR_0_5_FEEDBACK_EXT.2
CONTACTOR_3_FEEDBACK: IC1103.14(VOA) ; port CONTACTOR_0_5_FEEDBACK.3
CONTACTOR_3_FEEDBACK_EXT: R1104.2 ; port CONTACTOR_0_5_FEEDBACK_EXT.3
CONTACTOR_4_FEEDBACK: IC1103.13(VOB) ; port CONTACTOR_0_5_FEEDBACK.4
CONTACTOR_4_FEEDBACK_EXT: R1105.2 ; port CONTACTOR_0_5_FEEDBACK_EXT.4
CONTACTOR_5_FEEDBACK: IC1103.12(VOC) ; port CONTACTOR_0_5_FEEDBACK.5
CONTACTOR_5_FEEDBACK_EXT: R1106.2 ; port CONTACTOR_0_5_FEEDBACK_EXT.5
CONTACTOR_FEEDBACK_SUPPLY_EXT: C1103.1 C1104.1 C1105.1 IC1101.1(OUT) IC1102.1(VDD1) IC1103.1(VDD1) R1107.2 R1108.2 R1109.2 R1110.2 R1111.2 R1112.2
NetD1101_1: D1101.1(K) IC1102.3(VIA) R1101.2 R1107.1
NetD1102_1: D1102.1(K) IC1103.3(VIA) R1104.1 R1108.1
NetD1103_1: D1103.1(K) IC1102.4(VIB) R1102.2 R1109.1
NetD1104_1: D1104.1(K) IC1103.4(VIB) R1105.1 R1110.1
NetD1105_1: D1105.1(K) IC1102.5(VIC) R1103.2 R1111.1
NetD1106_1: D1106.1(K) IC1103.5(VIC) R1106.1 R1112.1

Not connected (* = marked no-connect by the designer): IC1102 6(NC)* 7(NC)* 11(NC)*; IC1103 6(NC)* 7(NC)* 11(NC)*

### Notes on the sheet
- Contactor Feedback Isolation 0 to 2
- Contactor Feedback Supply from External Supply
- (near IC1101) Pvmax <0.1W
- Contactor Feedback Isolation 3 to 5
- Fraunhofer IISB
- Schottkystr. 10
- developed by:
- 91058 Erlangen
- Germany
- Author
- Project
- License
- Description
- File
- Version
- Release Date
- Sheet
- www.foxbms.org
- www.iisb.fraunhofer.de
- foxBMS Team
- /

### Library data of the parts
C1101 = gen_C_ceramic_1u_35V_X7R_0603: MLCC; Capacitance: 1u; Rated Voltage: 35V; Dielectric: X7R; Case EIA: 0603; Case Metric: 1608; PnP Package: C_0603_10; PnP Value: 1uF/35V/X7R; PnP equipped: x; Automotive Qualified: False; Part Number: gen_C_ceramic_1u_35V_X7R_0603; Supplier 1: Farnell; Supplier Part Number 1: 1907508
C1102-C1107 = gen_C_ceramic_100n_50V_X7R_0603: as C1402-C1405 on sheet isolated_USB; Part Number: gen_C_ceramic_100n_50V_X7R_0603; Supplier 1: Farnell; Supplier Part Number 1: 2525267; Supplier 2: Digikey; Supplier Part Number 2: 490-6049-1-ND
D1101-D1106 = CDSOD323-T05: TVS Diode, CDSOD323 Series, Unidirectional, 5 V, 18.3 V, SOD-323, 2 Pins; Manufacturer: Bourns; Breakdown Voltage: 6V; Automotive Qualified: False; Part Number: CDSOD323-T05; Part Name: CDSOD323-T05; Operating Temperature: -55°C - +150°C; ComponentLink1Description: Datasheet; ComponentLink1URL: http://www.farnell.com/datasheets/1845299.pdf; Supplier 1: Farnell; Supplier Part Number 1: 2341914
IC1101 = CMP-2000-07341-1: Positive-Voltage Regulator, 100 mA, 0 to 125 degC, 3-Pin SOT-89 (PK), Green (RoHS & no Sb/Br), Tape and Reel; Manufacturer: TexasInstruments; Load Regulation: 60mV; Input Voltage MIN: 7V; Number of Outputs: 1; Input Voltage MAX: 20V; Output Type: Fixed; Output Current: 100mA; Output Voltage: 5V; PSRR / Ripple Rejection - Typ: 49dB; Line Regulation: 200mV; Mounting Style: SMD/SMT; Datasheet Version: Rev. U, 05/2011; Polarity: Positive; Minimum Operating Temperature: 0C; Package Reference: PK0003A; Brand: TexasInstruments; Packaging: Reel; Product Category: LinearVoltageRegulators; RoHS: True; Datasheet URL: http://www.ti.com/lit/ds/symlink/ua78l05.pdf; Package URL: http://www.ti.com/lit/ml/mhsi001b/mhsi001b.pdf; Series: UA78L05; Manufacturer URL: http://www.ti.com/; Package Description: 3-Pin Small Outline Transistor, Body 4.5 x 2.5 mm, Pitch 1.5 mm; Mounting Technology: SurfaceMount; Package / Case: SOT-89-4; Maximum Operating Temperature: +125C
IC1102 IC1103 = CMP-0534-00476-1: Triple Channel Digital Isolator, Enhanced System-Level ESD Reliability, 2.5 KV rms Insulation Rating, 90 Mbps Data Rate, 32 ns Delay, Industrial, 16-pin SOIC (RW-16), Tube; Manufacturer: Analog Devices; Max Data Rate: 90Mbps; Insulation Rating (kVrms): 2.5; Max Operating Temp (degreesC): 105; ComponentLink3Description: Package Specification; ComponentLink4URL: Product URL:http://www.analog.com/en/interface-isolation/digital-isolators/adum3300/products/product.html; Code_JEDEC: MS-013-AA; PackageDescription: 16-Pin Standard Small Outline Package, Body 10.3 x 7.5 mm, Pitch 1.27 mm; ComponentLink4Description: URL Link1; ComponentLink1URL: http://www.analog.com/en/index.html; ComponentLink2URL: http://www.analog.com/static/imported-files/data_sheets/ADUM3300_3301.pdf; ComponentLink2Description: Datasheet; ComponentLink1Description: Manufacturer URL; PackageVersion: 032707-B, 03/2007; PackageReference: RW-16; PartNumber: ADUM3300CRWZ; Mounting Technology: Surface Mount; ComponentLink3URL: http://www.analog.com/static/imported-files/packages/PKG_PDF/SOIC_WIDE%20%28RW%29/RW_16.pdf; DatasheetVersion: Rev. B
R1101-R1106 = gen_R_47R_0603: SMD Resistor 47R 0603; Tolerance: 1%; Power: 0.1W; Case EIA: 0603; Case Metric: 1608; Maximum Working Voltage: 75V; PnP Package: R_0603; Automotive Qualified: False; Part Number: gen_R_47R_0603; Operating Temperature: -55°C - +155°C; Resistance: 47R; Series: E24; PnP Value: 47R; Supplier 1: Farnell; Supplier Part Number 1: 2303030
R1107-R1112 = gen_R_10k_0603: as R903 on sheet interlock_circuit; Part Number: gen_R_10k_0603; Operating Temperature: -55°C - +155°C; Resistance: 10k; Series: E24, E96; PnP Value: 10k; Supplier 1: Farnell; Supplier Part Number 1: 2073349

## Sheet contactor_connectors.SchDoc: foxBMS BMS-Master
size A3; DocumentNumber: 18; SheetNumber: 18; SheetTotal: 24; Author: Fraunhofer IISB foxBMS Team; REL-DATE: 2017-05-16; VERSION: 1.0.2; SheetDescription: Contactor Connectors
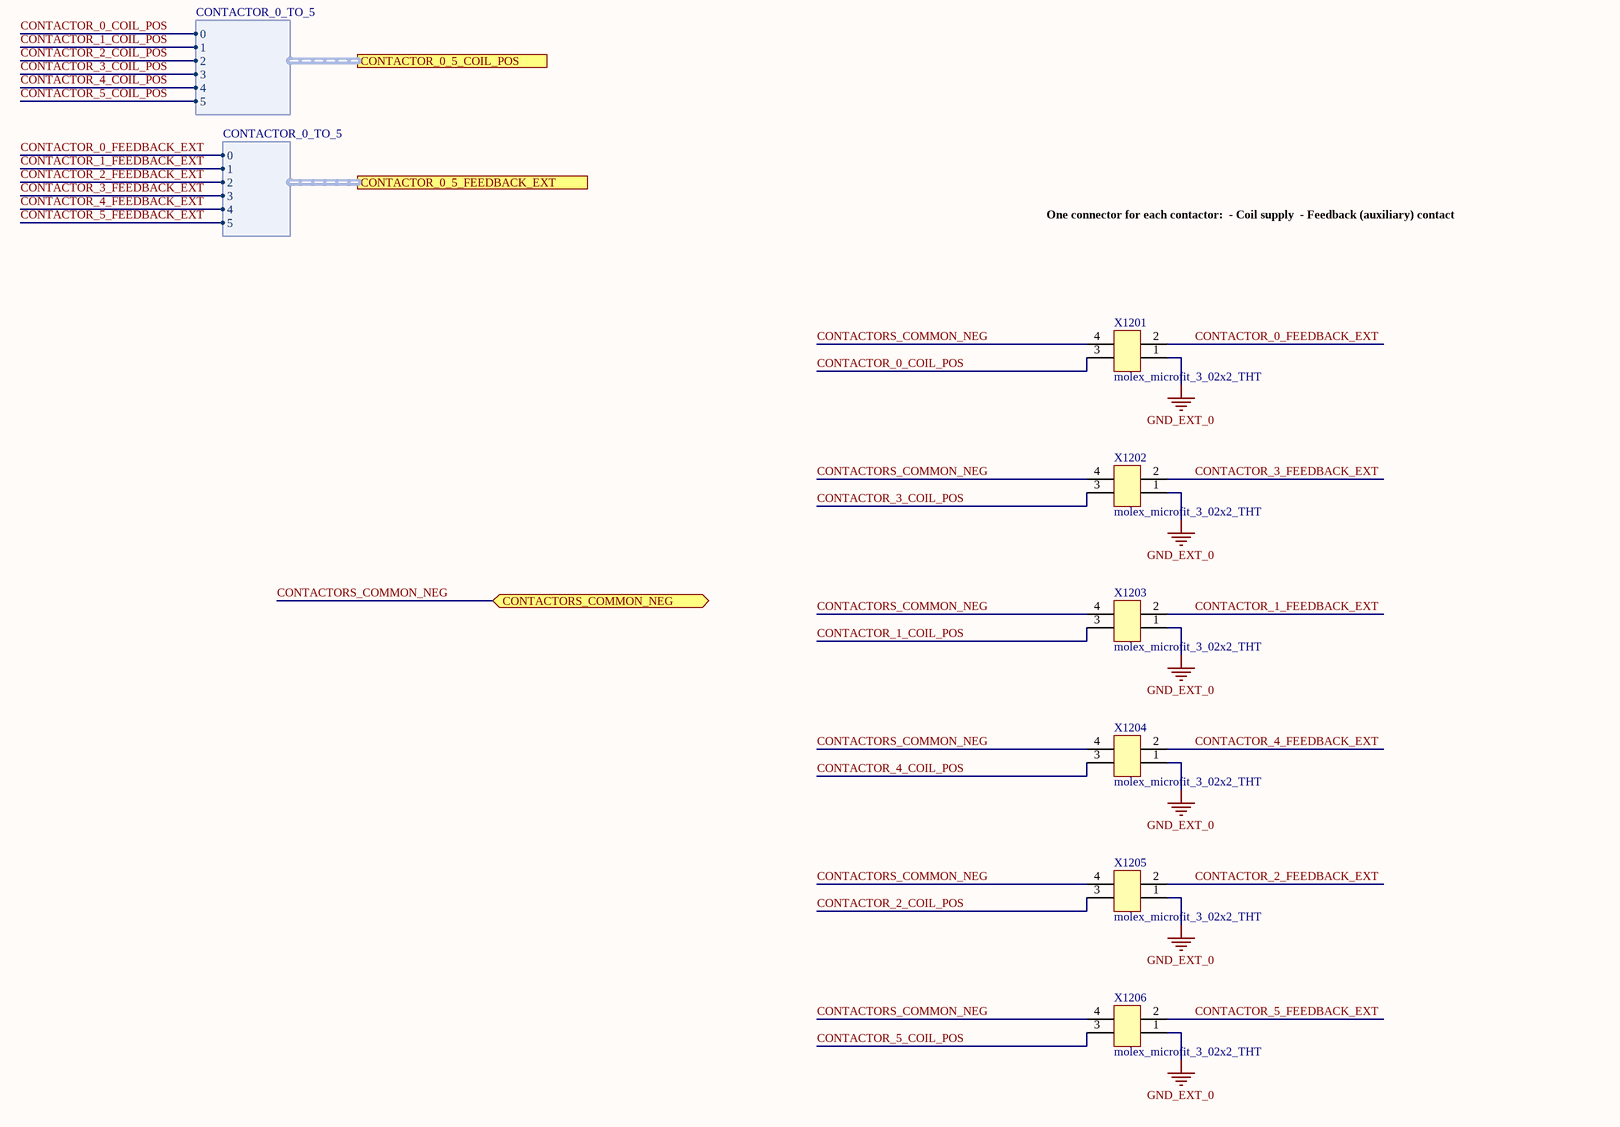
[diagram p21: contactor_connectors.SchDoc]

### Parts
X1201  molex_microfit_3_02x2_THT  [MOLEX_MICROFIT_02x2_THT]
X1202  molex_microfit_3_02x2_THT  [MOLEX_MICROFIT_02x2_THT]
X1203  molex_microfit_3_02x2_THT  [MOLEX_MICROFIT_02x2_THT]
X1204  molex_microfit_3_02x2_THT  [MOLEX_MICROFIT_02x2_THT]
X1205  molex_microfit_3_02x2_THT  [MOLEX_MICROFIT_02x2_THT]
X1206  molex_microfit_3_02x2_THT  [MOLEX_MICROFIT_02x2_THT]

### Ports
CONTACTOR_0_5_COIL_POS (harness CONTACTOR_0_TO_5), CONTACTOR_0_5_FEEDBACK_EXT (harness CONTACTOR_0_TO_5), CONTACTORS_COMMON_NEG (bidir)

### Harnesses
CONTACTOR_0_TO_5: 0, 1, 2, 3, 4, 5

### Nets
GND_EXT_0: X1201.1 X1202.1 X1203.1 X1204.1 X1205.1 X1206.1
CONTACTOR_0_COIL_POS: X1201.3 ; port CONTACTOR_0_5_COIL_POS.0
CONTACTOR_0_FEEDBACK_EXT: X1201.2 ; port CONTACTOR_0_5_FEEDBACK_EXT.0
CONTACTOR_1_COIL_POS: X1203.3 ; port CONTACTOR_0_5_COIL_POS.1
CONTACTOR_1_FEEDBACK_EXT: X1203.2 ; port CONTACTOR_0_5_FEEDBACK_EXT.1
CONTACTOR_2_COIL_POS: X1205.3 ; port CONTACTOR_0_5_COIL_POS.2
CONTACTOR_2_FEEDBACK_EXT: X1205.2 ; port CONTACTOR_0_5_FEEDBACK_EXT.2
CONTACTOR_3_COIL_POS: X1202.3 ; port CONTACTOR_0_5_COIL_POS.3
CONTACTOR_3_FEEDBACK_EXT: X1202.2 ; port CONTACTOR_0_5_FEEDBACK_EXT.3
CONTACTOR_4_COIL_POS: X1204.3 ; port CONTACTOR_0_5_COIL_POS.4
CONTACTOR_4_FEEDBACK_EXT: X1204.2 ; port CONTACTOR_0_5_FEEDBACK_EXT.4
CONTACTOR_5_COIL_POS: X1206.3 ; port CONTACTOR_0_5_COIL_POS.5
CONTACTOR_5_FEEDBACK_EXT: X1206.2 ; port CONTACTOR_0_5_FEEDBACK_EXT.5
CONTACTORS_COMMON_NEG: X1201.4 X1202.4 X1203.4 X1204.4 X1205.4 X1206.4 ; port CONTACTORS_COMMON_NEG

### Notes on the sheet
- One connector for each contactor:
  - Coil supply
  - Feedback (auxiliary) contact
- Fraunhofer IISB
- Schottkystr. 10
- developed by:
- 91058 Erlangen
- Germany
- Author
- Project
- License
- Description
- File
- Version
- Release Date
- Sheet
- www.foxbms.org
- www.iisb.fraunhofer.de
- foxBMS Team
- /

### Library data of the parts
X1201-X1206 = molex_microfit_3_02x2_THT: Micro-Fit 3.0 Right Angle Header, 3.00mm Pitch, Dual Row, 4 Circuits, with Snap-in Plastic Peg PCB Lock, Tin, Glow Wire Capable, Black, 43045-0400; Manufacturer: Molex; Circuits: 4; Rated Voltage: 600V; Rated Current: 8.5A; Automotive Qualified: False; Part Number: molex_microfit_3_02x2_THT; Part Name: MicroFit; Operating Temperature: -40°C - +105°C; Supplier 1: Farnell; Supplier Part Number 1: 9733019

## Sheet EEPROM.SchDoc: foxBMS BMS-Master
size A3; DocumentNumber: 20; SheetNumber: 20; SheetTotal: 24; Author: Fraunhofer IISB foxBMS Team; REL-DATE: 2017-05-16; VERSION: 1.0.2; SheetDescription: EEPROM
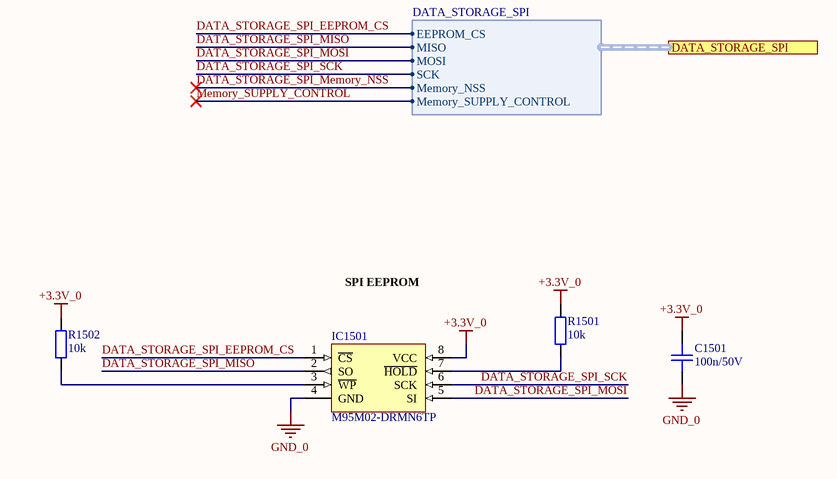
[diagram p22: EEPROM.SchDoc]

### Parts
C1501  100n/50V  [CAPC1608X08N]
IC1501  M95M02-DRMN6TP  [SOIC127P600X175-8N]
R1501  10k  [RESC1608X05N]
R1502  10k  [RESC1608X05N]

### Ports
DATA_STORAGE_SPI (harness DATA_STORAGE_SPI)

### Harnesses
DATA_STORAGE_SPI: EEPROM_CS, MISO, MOSI, SCK, Memory_NSS, Memory_SUPPLY_CONTROL

### Nets
+3.3V_0: C1501.2 IC1501.8(VCC) R1501.2 R1502.2
GND_0: C1501.1 IC1501.4(GND)
DATA_STORAGE_SPI_EEPROM_CS: IC1501.1(~{CS}) ; port DATA_STORAGE_SPI.EEPROM_CS
DATA_STORAGE_SPI_MISO: IC1501.2(SO) ; port DATA_STORAGE_SPI.MISO
DATA_STORAGE_SPI_MOSI: IC1501.5(SI) ; port DATA_STORAGE_SPI.MOSI
DATA_STORAGE_SPI_SCK: IC1501.6(SCK) ; port DATA_STORAGE_SPI.SCK
NetIC1501_3: IC1501.3(~{WP}) R1502.1
NetIC1501_7: IC1501.7(~{HOLD}) R1501.1

### Notes on the sheet
- SPI EEPROM
- Fraunhofer IISB
- Schottkystr. 10
- developed by:
- 91058 Erlangen
- Germany
- Author
- Project
- License
- Description
- File
- Version
- Release Date
- Sheet
- www.foxbms.org
- www.iisb.fraunhofer.de
- foxBMS Team
- /

### Library data of the parts
C1501 = gen_C_ceramic_100n_50V_X7R_0603: as C1402-C1405 on sheet isolated_USB; Part Number: gen_C_ceramic_100n_50V_X7R_0603; Supplier 1: Farnell; Supplier Part Number 1: 2525267; Supplier 2: Digikey; Supplier Part Number 2: 490-6049-1-ND
IC1501 = M95M02-DRMN6TP: 2-Mbit serial SPI bus EEPROM; Manufacturer: StMicroelectronics; PnP Package: SOIC-8; Automotive Qualified: False; Part Number: M95M02-DRMN6TP; Part Name: M95M02-DRMN6TP; Operating Temperature: -40°C - +85°C; ComponentLink1Description: Datasheet; ComponentLink1URL: http://www.st.com/resource/en/datasheet/m95m02-dr.pdf; Supplier 1: Farnell; Supplier Part Number 1: 2849991; Supplier 2: Digikey; Supplier Part Number 2: 497-11405-1-ND
R1501 R1502 = gen_R_10k_0603: as R903 on sheet interlock_circuit; Part Number: gen_R_10k_0603; Operating Temperature: -55°C - +155°C; Resistance: 10k; Series: E24, E96; PnP Value: 10k; Supplier 1: Farnell; Supplier Part Number 1: 2073349

## Sheet bms-interface_interface.SchDoc: foxBMS BMS-Master
size A3; DocumentNumber: 21; SheetNumber: 21; SheetTotal: 24; Author: Fraunhofer IISB foxBMS Team; REL-DATE: 2017-05-16; VERSION: 1.0.2; SheetDescription: Interface to BMS-Interface
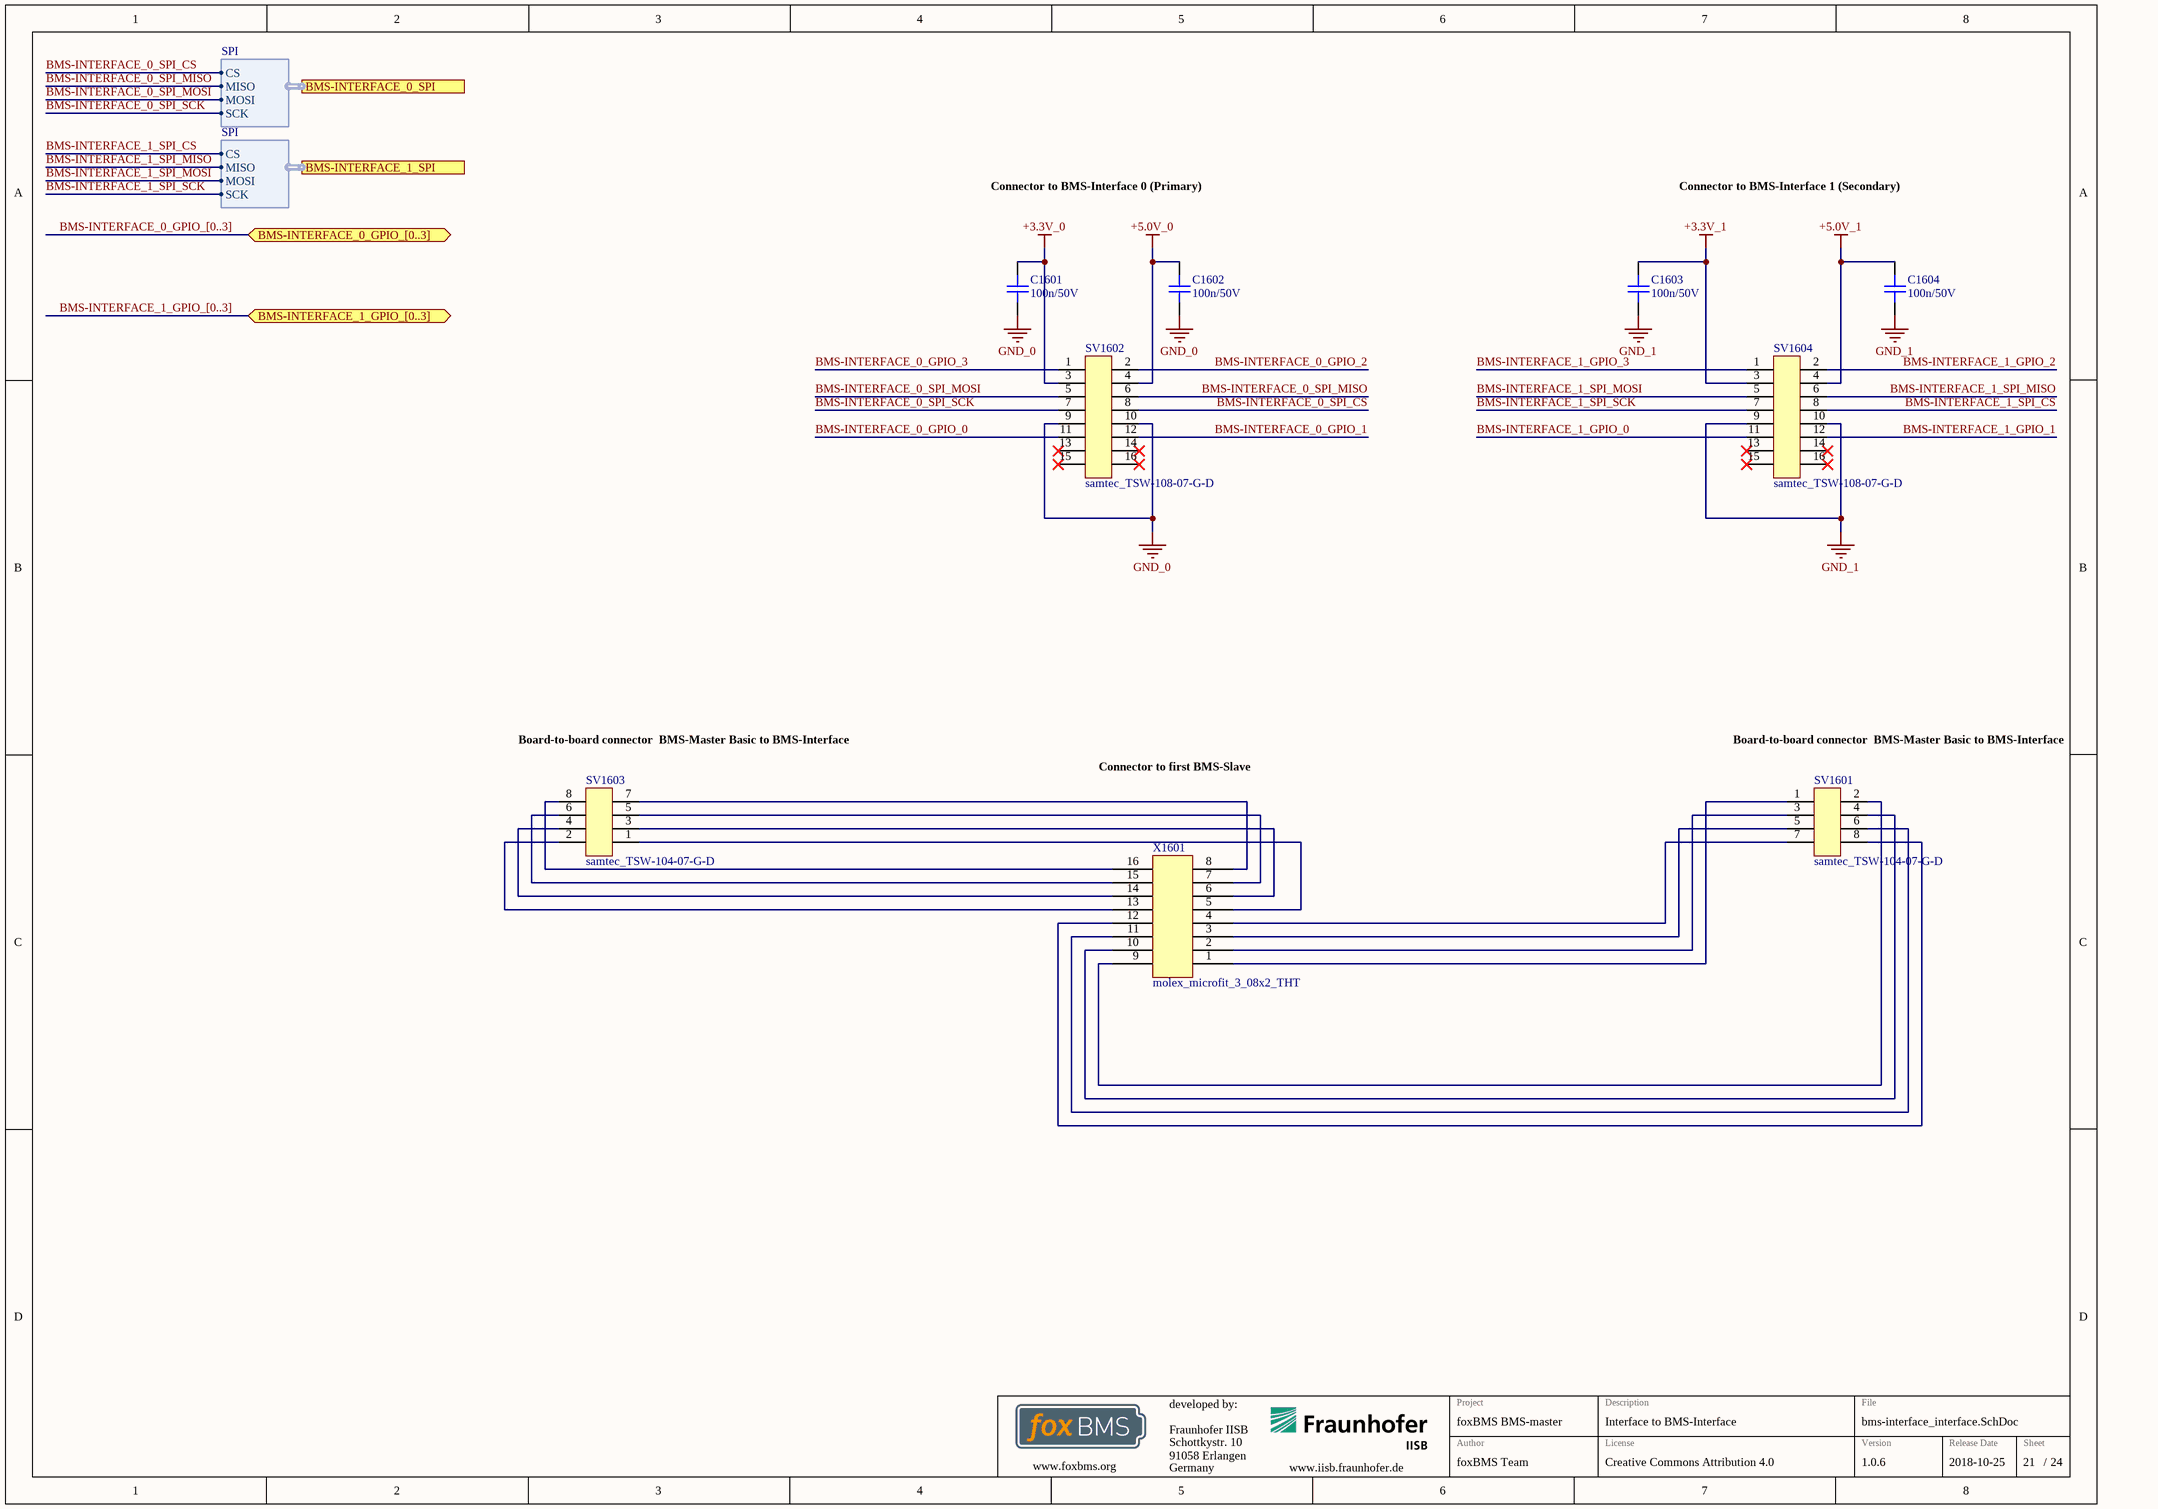
[diagram p23: bms-interface_interface.SchDoc]

### Parts
C1601  100n/50V  [CAPC1608X08N]
C1602  100n/50V  [CAPC1608X08N]
C1603  100n/50V  [CAPC1608X08N]
C1604  100n/50V  [CAPC1608X08N]
SV1601  samtec_TSW-104-07-G-D  [Pinheader_2.54_2x4]
SV1602  samtec_TSW-108-07-G-D  [Pinheader_2.54_2x8]
SV1603  samtec_TSW-104-07-G-D  [Pinheader_2.54_2x4]
SV1604  samtec_TSW-108-07-G-D  [Pinheader_2.54_2x8]
X1601  molex_microfit_3_08x2_THT  [MOLEX_MICROFIT_08x2_THT]

### Ports
BMS-INTERFACE_0_GPIO_[0..3] (bidir), BMS-INTERFACE_0_SPI (harness SPI), BMS-INTERFACE_1_GPIO_[0..3] (bidir), BMS-INTERFACE_1_SPI (harness SPI)

### Harnesses
SPI: CS, MISO, MOSI, SCK

### Nets
+3.3V_0: C1601.1 SV1602.3
+3.3V_1: C1603.1 SV1604.3
+5.0V_0: C1602.1 SV1602.4
+5.0V_1: C1604.1 SV1604.4
GND_0: C1601.2 C1602.2 SV1602.9 SV1602.10
GND_1: C1603.2 C1604.2 SV1604.9 SV1604.10
BMS-INTERFACE_0_GPIO_0: SV1602.11
BMS-INTERFACE_0_GPIO_1: SV1602.12
BMS-INTERFACE_0_GPIO_2: SV1602.2
BMS-INTERFACE_0_GPIO_3: SV1602.1
BMS-INTERFACE_0_SPI_CS: SV1602.8 ; port BMS-INTERFACE_0_SPI.CS
BMS-INTERFACE_0_SPI_MISO: SV1602.6 ; port BMS-INTERFACE_0_SPI.MISO
BMS-INTERFACE_0_SPI_MOSI: SV1602.5 ; port BMS-INTERFACE_0_SPI.MOSI
BMS-INTERFACE_0_SPI_SCK: SV1602.7 ; port BMS-INTERFACE_0_SPI.SCK
BMS-INTERFACE_1_GPIO_0: SV1604.11
BMS-INTERFACE_1_GPIO_1: SV1604.12
BMS-INTERFACE_1_GPIO_2: SV1604.2
BMS-INTERFACE_1_GPIO_3: SV1604.1
BMS-INTERFACE_1_SPI_CS: SV1604.8 ; port BMS-INTERFACE_1_SPI.CS
BMS-INTERFACE_1_SPI_MISO: SV1604.6 ; port BMS-INTERFACE_1_SPI.MISO
BMS-INTERFACE_1_SPI_MOSI: SV1604.5 ; port BMS-INTERFACE_1_SPI.MOSI
BMS-INTERFACE_1_SPI_SCK: SV1604.7 ; port BMS-INTERFACE_1_SPI.SCK
NetSV1601_1: SV1601.1 X1601.1
NetSV1601_2: SV1601.2 X1601.9
NetSV1601_3: SV1601.3 X1601.2
NetSV1601_4: SV1601.4 X1601.10
NetSV1601_5: SV1601.5 X1601.3
NetSV1601_6: SV1601.6 X1601.11
NetSV1601_7: SV1601.7 X1601.4
NetSV1601_8: SV1601.8 X1601.12
NetSV1603_1: SV1603.1 X1601.5
NetSV1603_2: SV1603.2 X1601.13
NetSV1603_3: SV1603.3 X1601.6
NetSV1603_4: SV1603.4 X1601.14
NetSV1603_5: SV1603.5 X1601.7
NetSV1603_6: SV1603.6 X1601.15
NetSV1603_7: SV1603.7 X1601.8
NetSV1603_8: SV1603.8 X1601.16

Not connected (* = marked no-connect by the designer): SV1602 13* 14* 15* 16*; SV1604 13* 14* 15* 16*

### Buses and harness runs
bus BMS-INTERFACE_0_GPIO_[0..3] = port BMS-INTERFACE_0_GPIO_[0..3]
bus BMS-INTERFACE_1_GPIO_[0..3] = port BMS-INTERFACE_1_GPIO_[0..3]

### Notes on the sheet
- Connector to BMS-Interface 0 (Primary)
- Connector to BMS-Interface 1 (Secondary)
- Board-to-board connector
  BMS-Master Basic to BMS-Interface
- Connector to first BMS-Slave
- Fraunhofer IISB
- Schottkystr. 10
- developed by:
- 91058 Erlangen
- Germany
- Author
- Project
- License
- Description
- File
- Version
- Release Date
- Sheet
- www.foxbms.org
- www.iisb.fraunhofer.de
- foxBMS Team
- /

### Library data of the parts
C1601-C1604 = gen_C_ceramic_100n_50V_X7R_0603: as C1402-C1405 on sheet isolated_USB; Part Number: gen_C_ceramic_100n_50V_X7R_0603; Supplier 1: Farnell; Supplier Part Number 1: 2525267; Supplier 2: Digikey; Supplier Part Number 2: 490-6049-1-ND
SV1601 SV1603 = samtec_TSW-104-07-G-D: Board-To-Board Connector, Vertical, 2.54 mm, 8 Contacts, Header, TSW Series, Through Hole, 2 Rows; Manufacturer: Samtec; Circuits: 8; Rated Voltage: 500V AC mated with SSW; Automotive Qualified: False; Part Number: samtec_TSW-104-07-G-D; Part Name: TSW-104-07-G-D; Operating Temperature: -55°C - +125°C; ComponentLink1Description: Datasheet; ComponentLink1URL: http://www.farnell.com/datasheets/1992055.pdf; Supplier 1: Farnell; Supplier Part Number 1: 2025250
SV1602 SV1604 = samtec_TSW-108-07-G-D: Board-To-Board Connector, Vertical, 2.54 mm, 16 Contacts, Header, TSW Series, Through Hole, 2 Rows; Manufacturer: Samtec; Circuits: 16; Rated Voltage: 500V AC mated with SSW; Automotive Qualified: False; Part Number: samtec_TSW-108-07-G-D; Part Name: TSW-108-07-G-D; Operating Temperature: -55°C - +125°C; ComponentLink1Description: Datasheet; ComponentLink1URL: http://www.farnell.com/datasheets/2061825.pdf; Supplier 1: Farnell; Supplier Part Number 1: 2578721
X1601 = molex_microfit_3_08x2_THT: Micro-Fit 3.0 Right Angle Header, 3.00mm Pitch, Dual Row, 16 Circuits, with Snap-in Plastic Peg PCB Lock, Tin, Glow Wire Capable, Black, 43045-1600; Manufacturer: Molex; Circuits: 16; Rated Voltage: 600V; Rated Current: 8.5A; Automotive Qualified: False; Part Number: molex_microfit_3_08x2_THT; Part Name: MicroFit; Operating Temperature: -40°C - +105°C; Supplier 1: Farnell; Supplier Part Number 1: 9961380